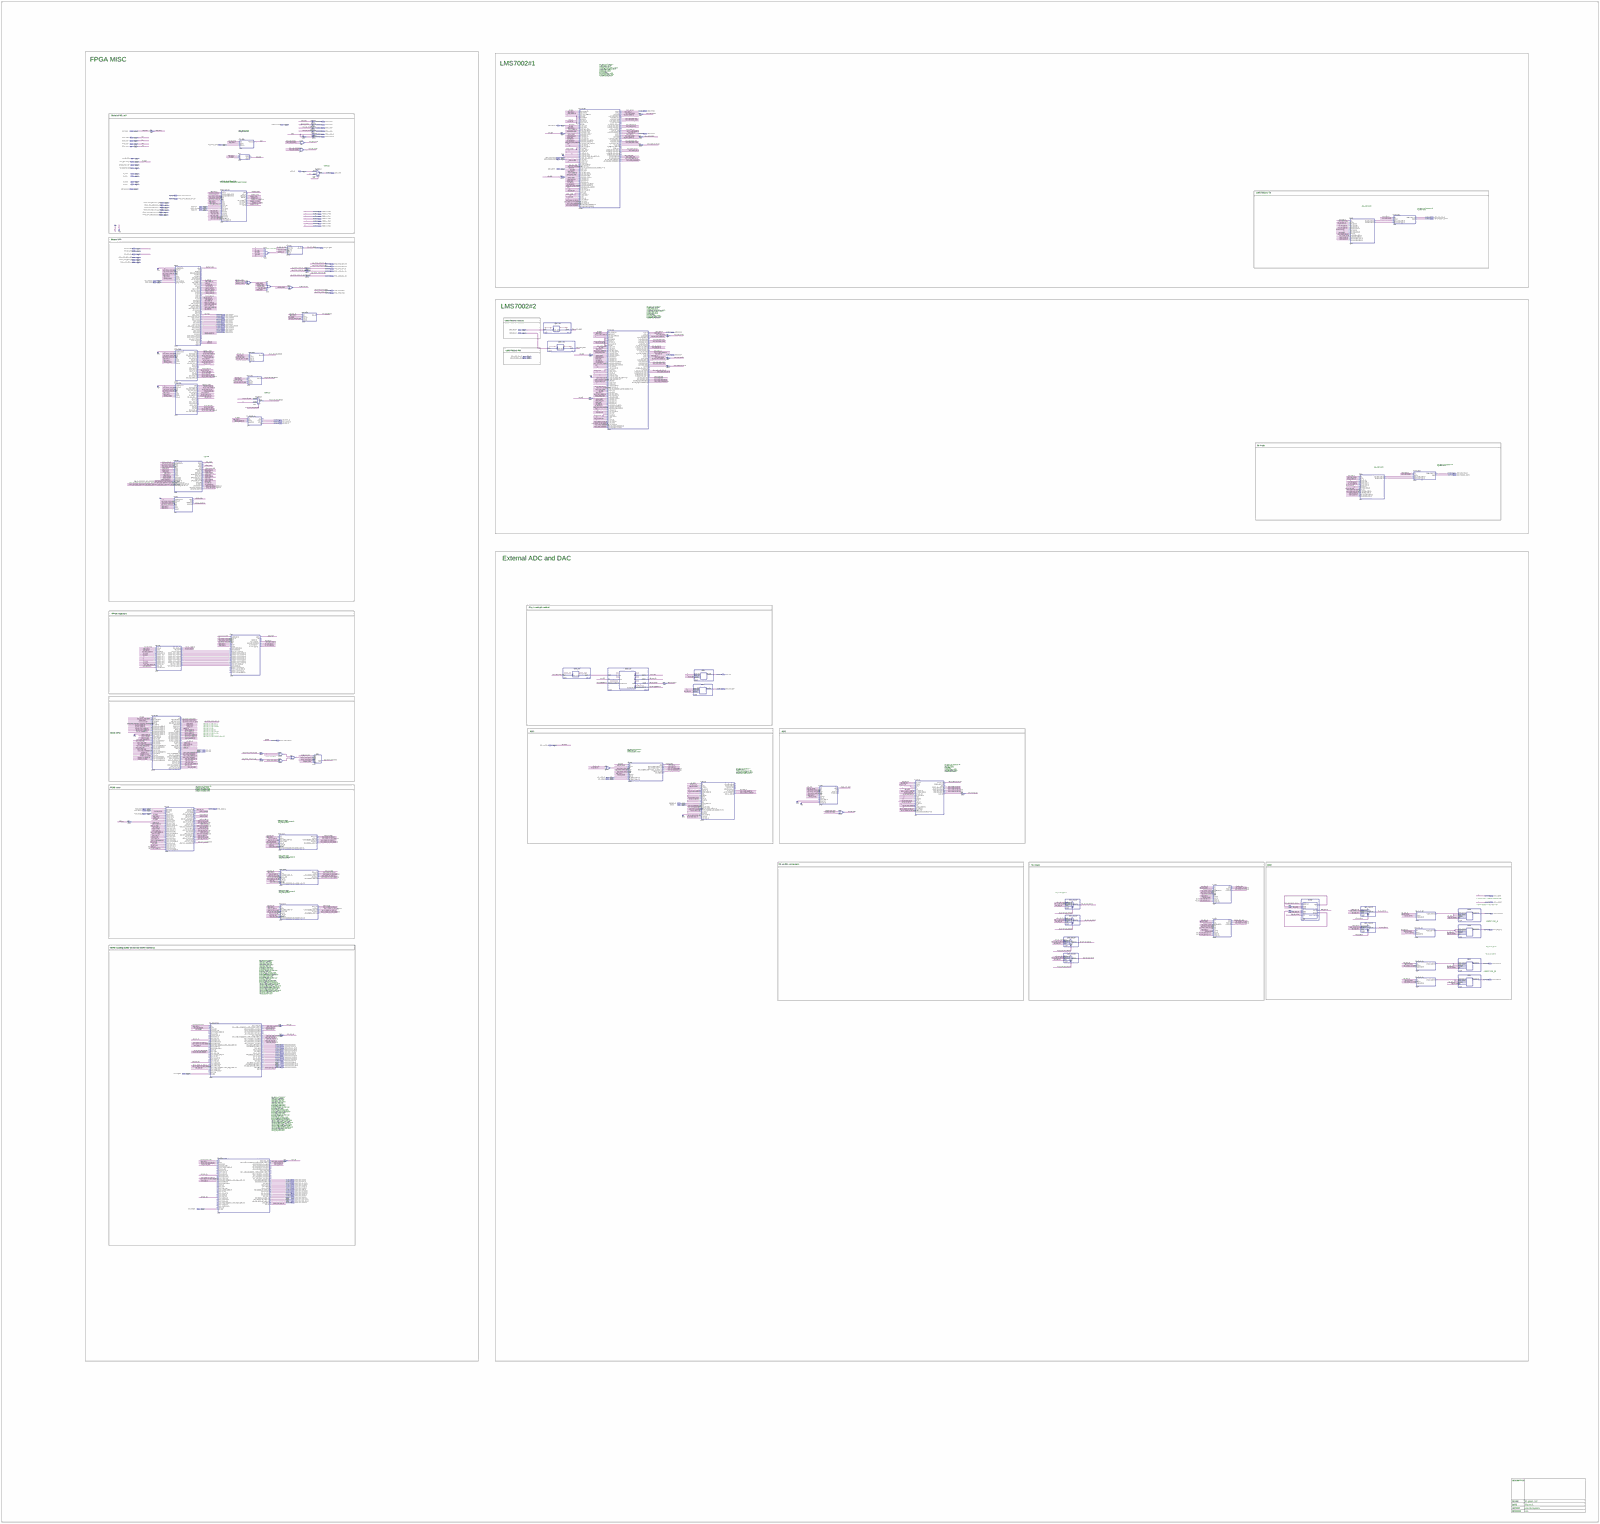
[diagram p0: schematic sheet, whole]
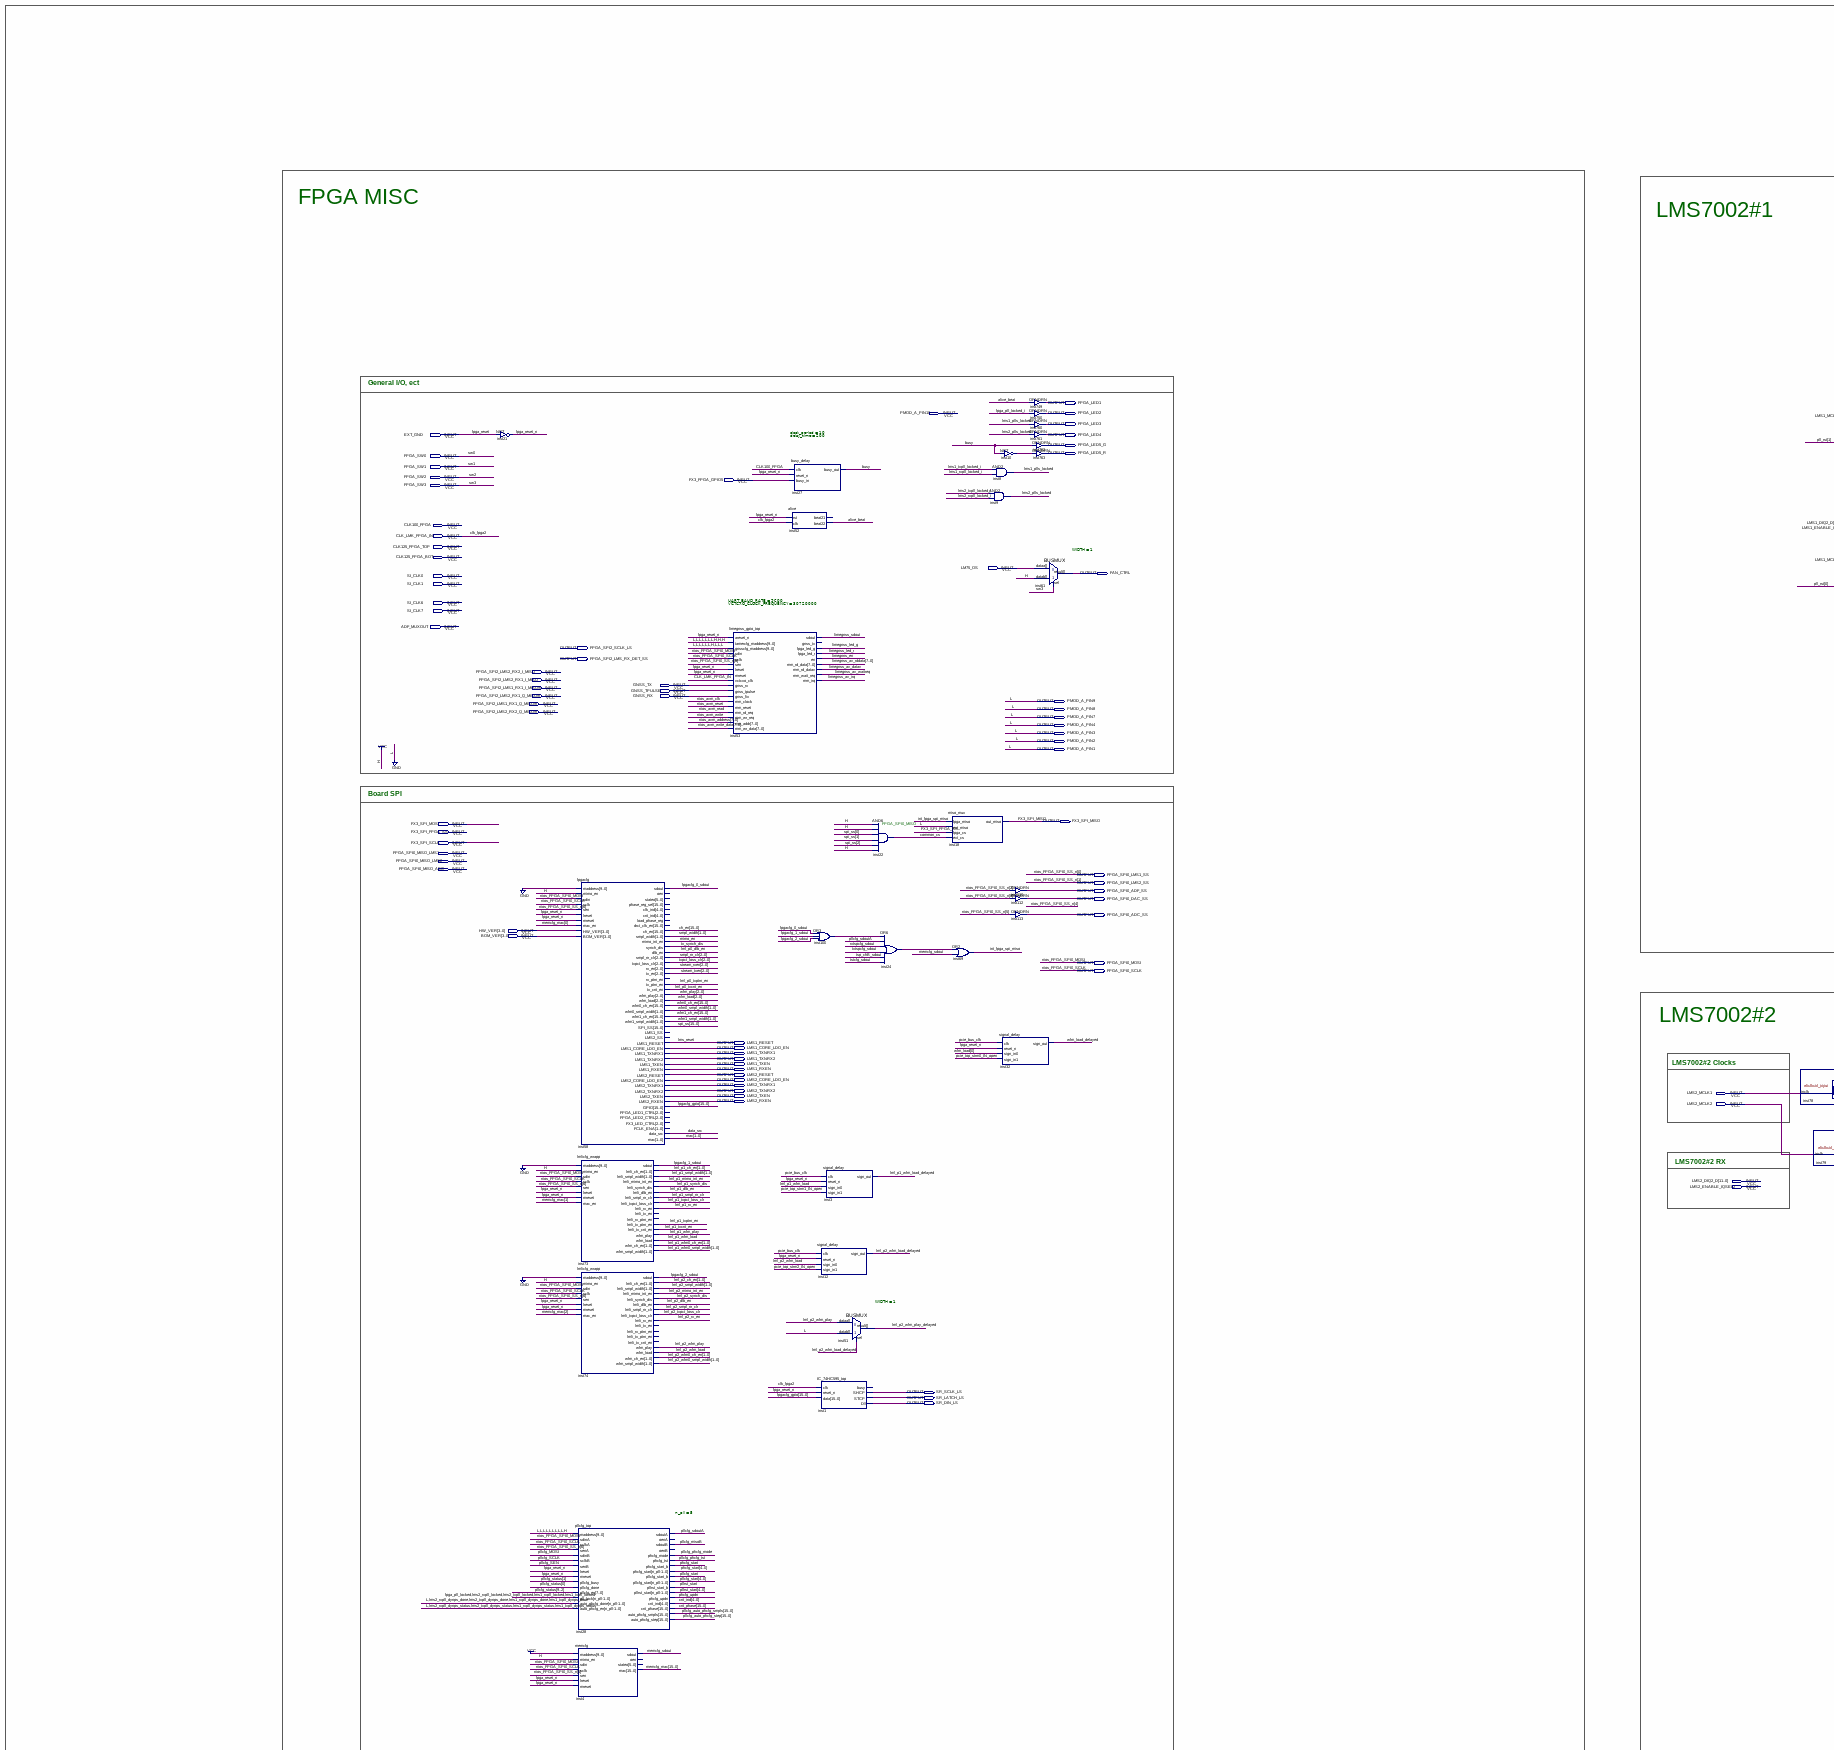
[diagram p1: schematic sheet, upper left part]
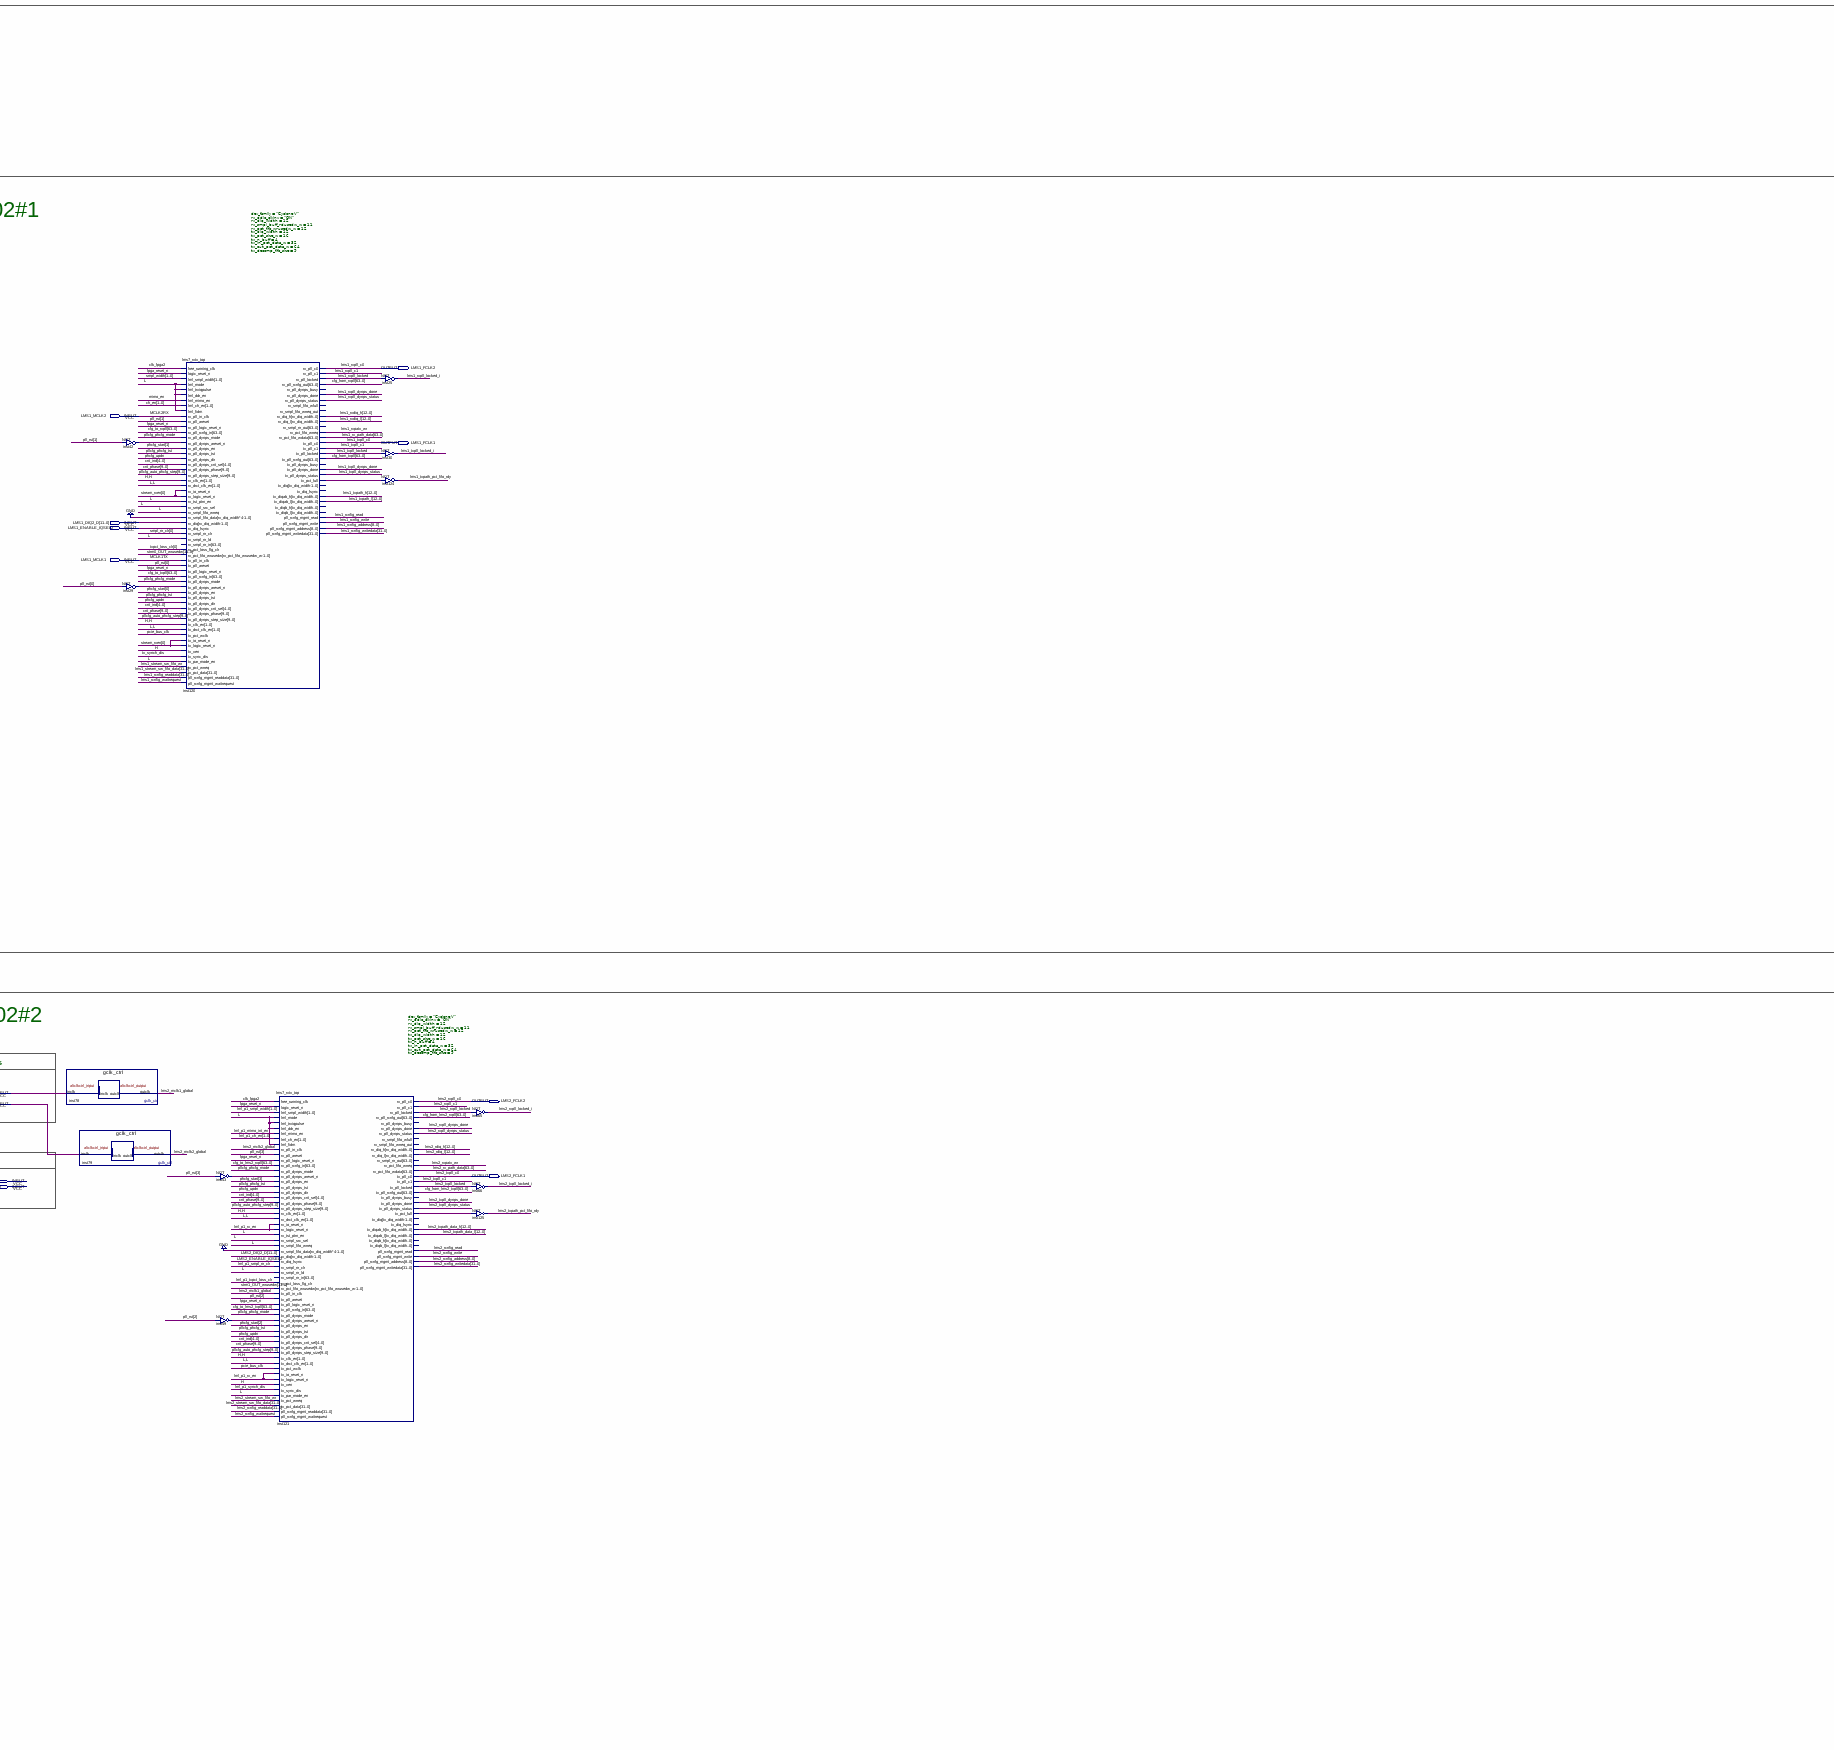
[diagram p2: schematic sheet, upper centre part]
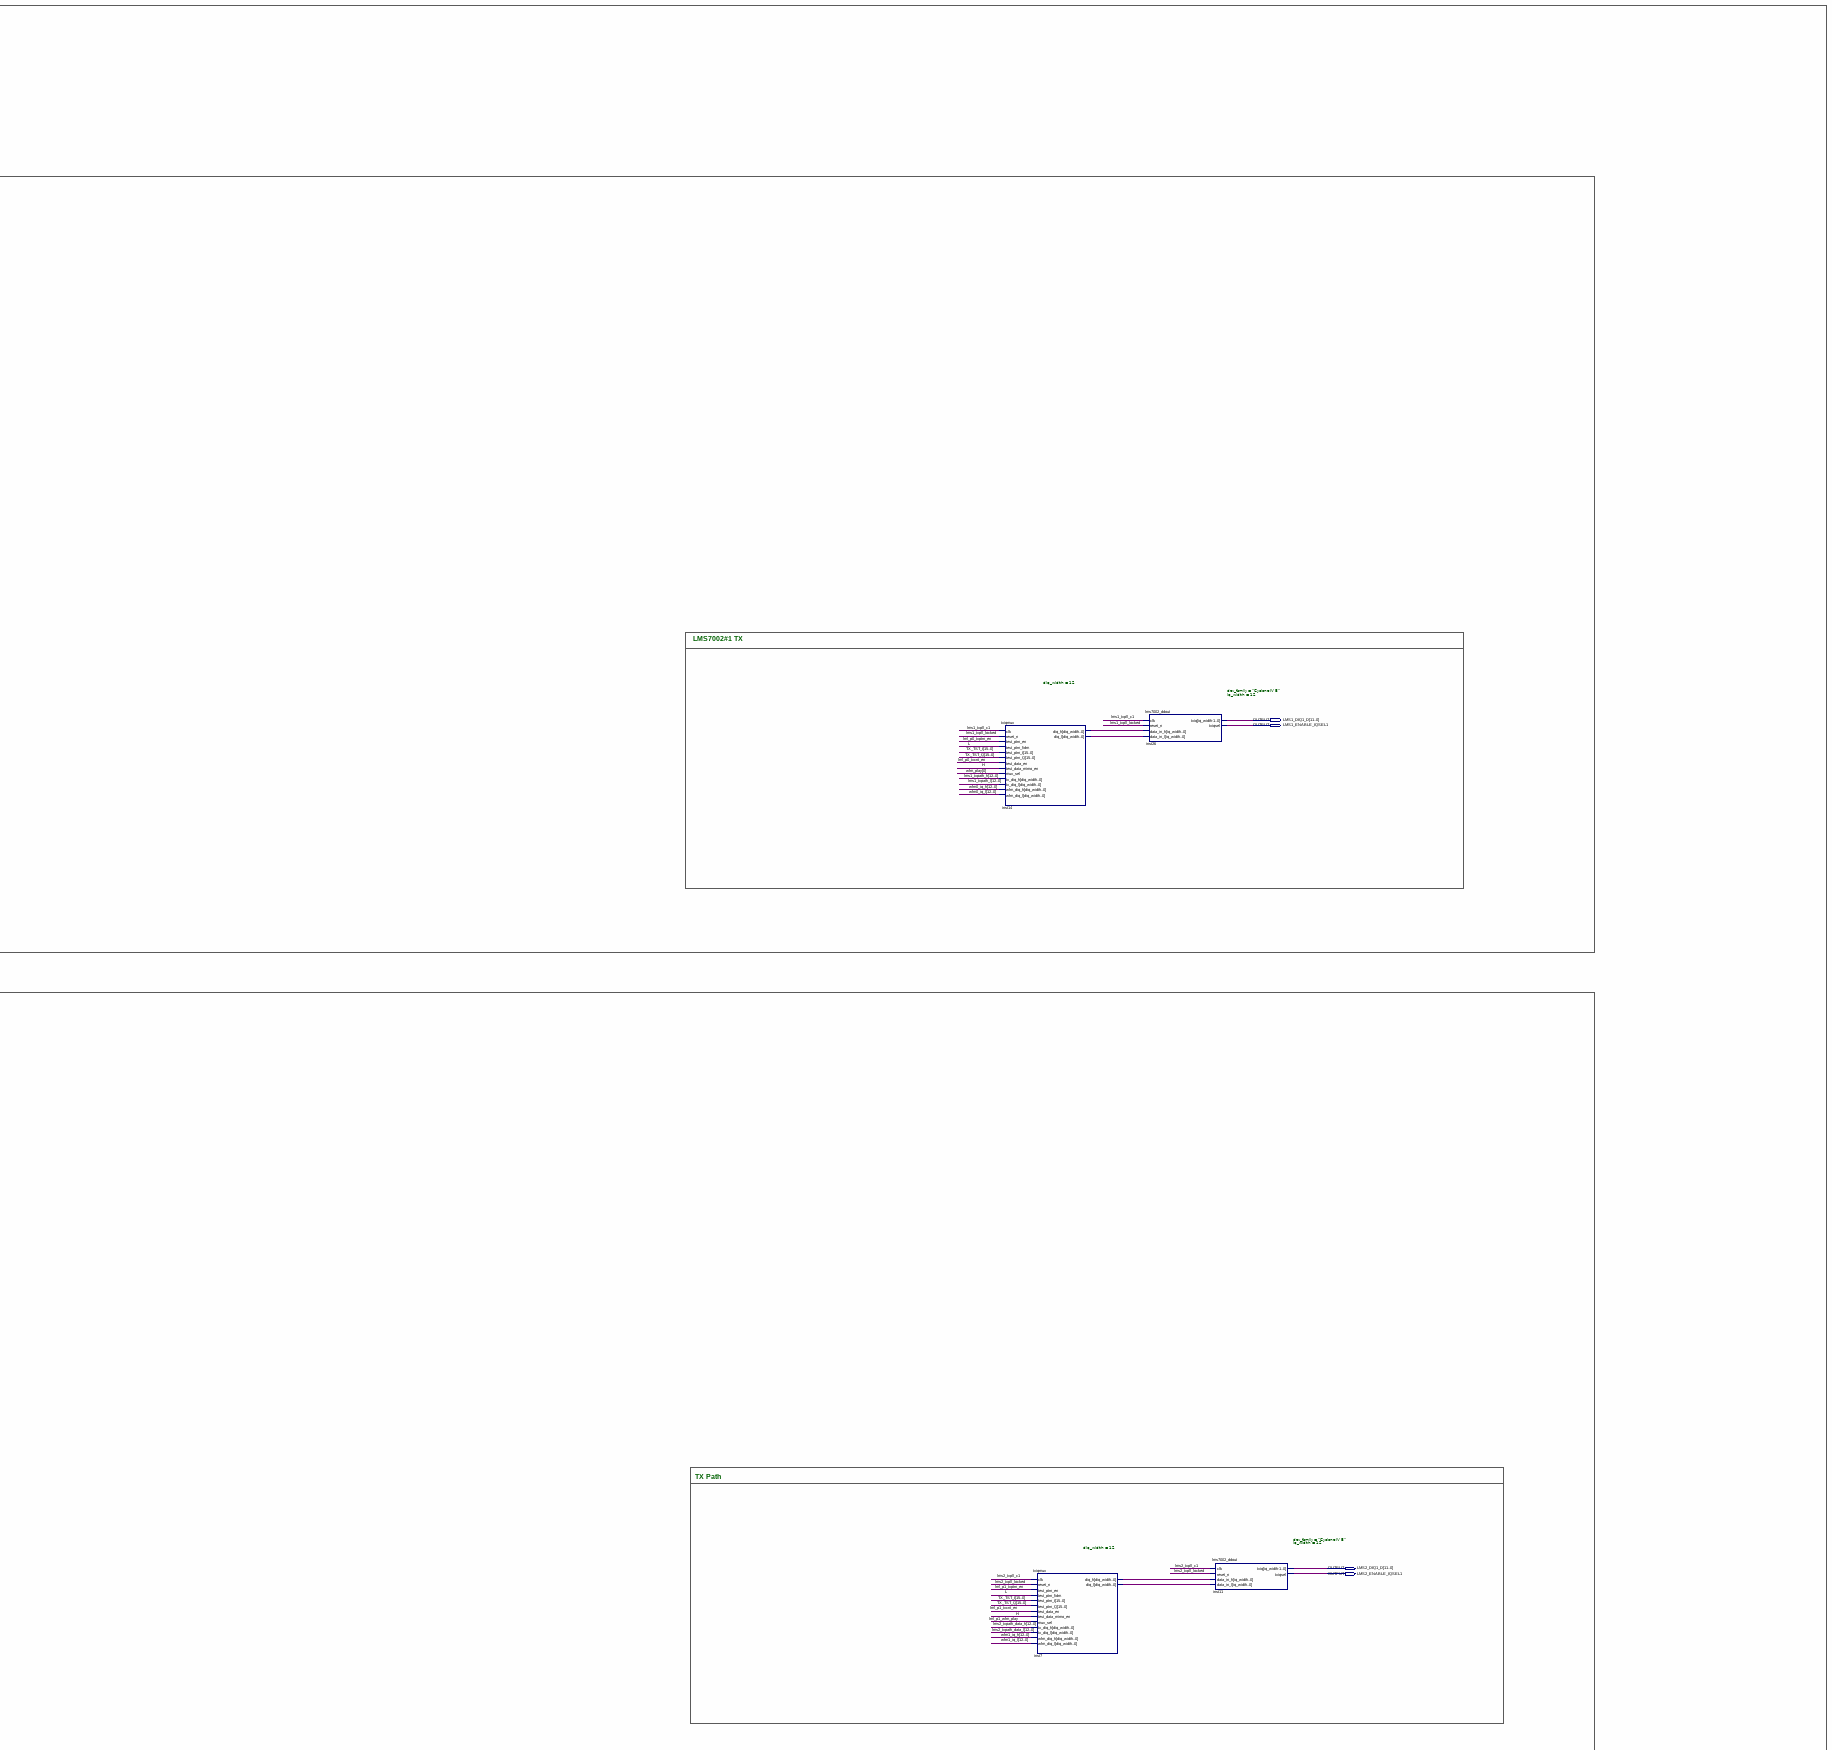
[diagram p3: schematic sheet, upper right part]
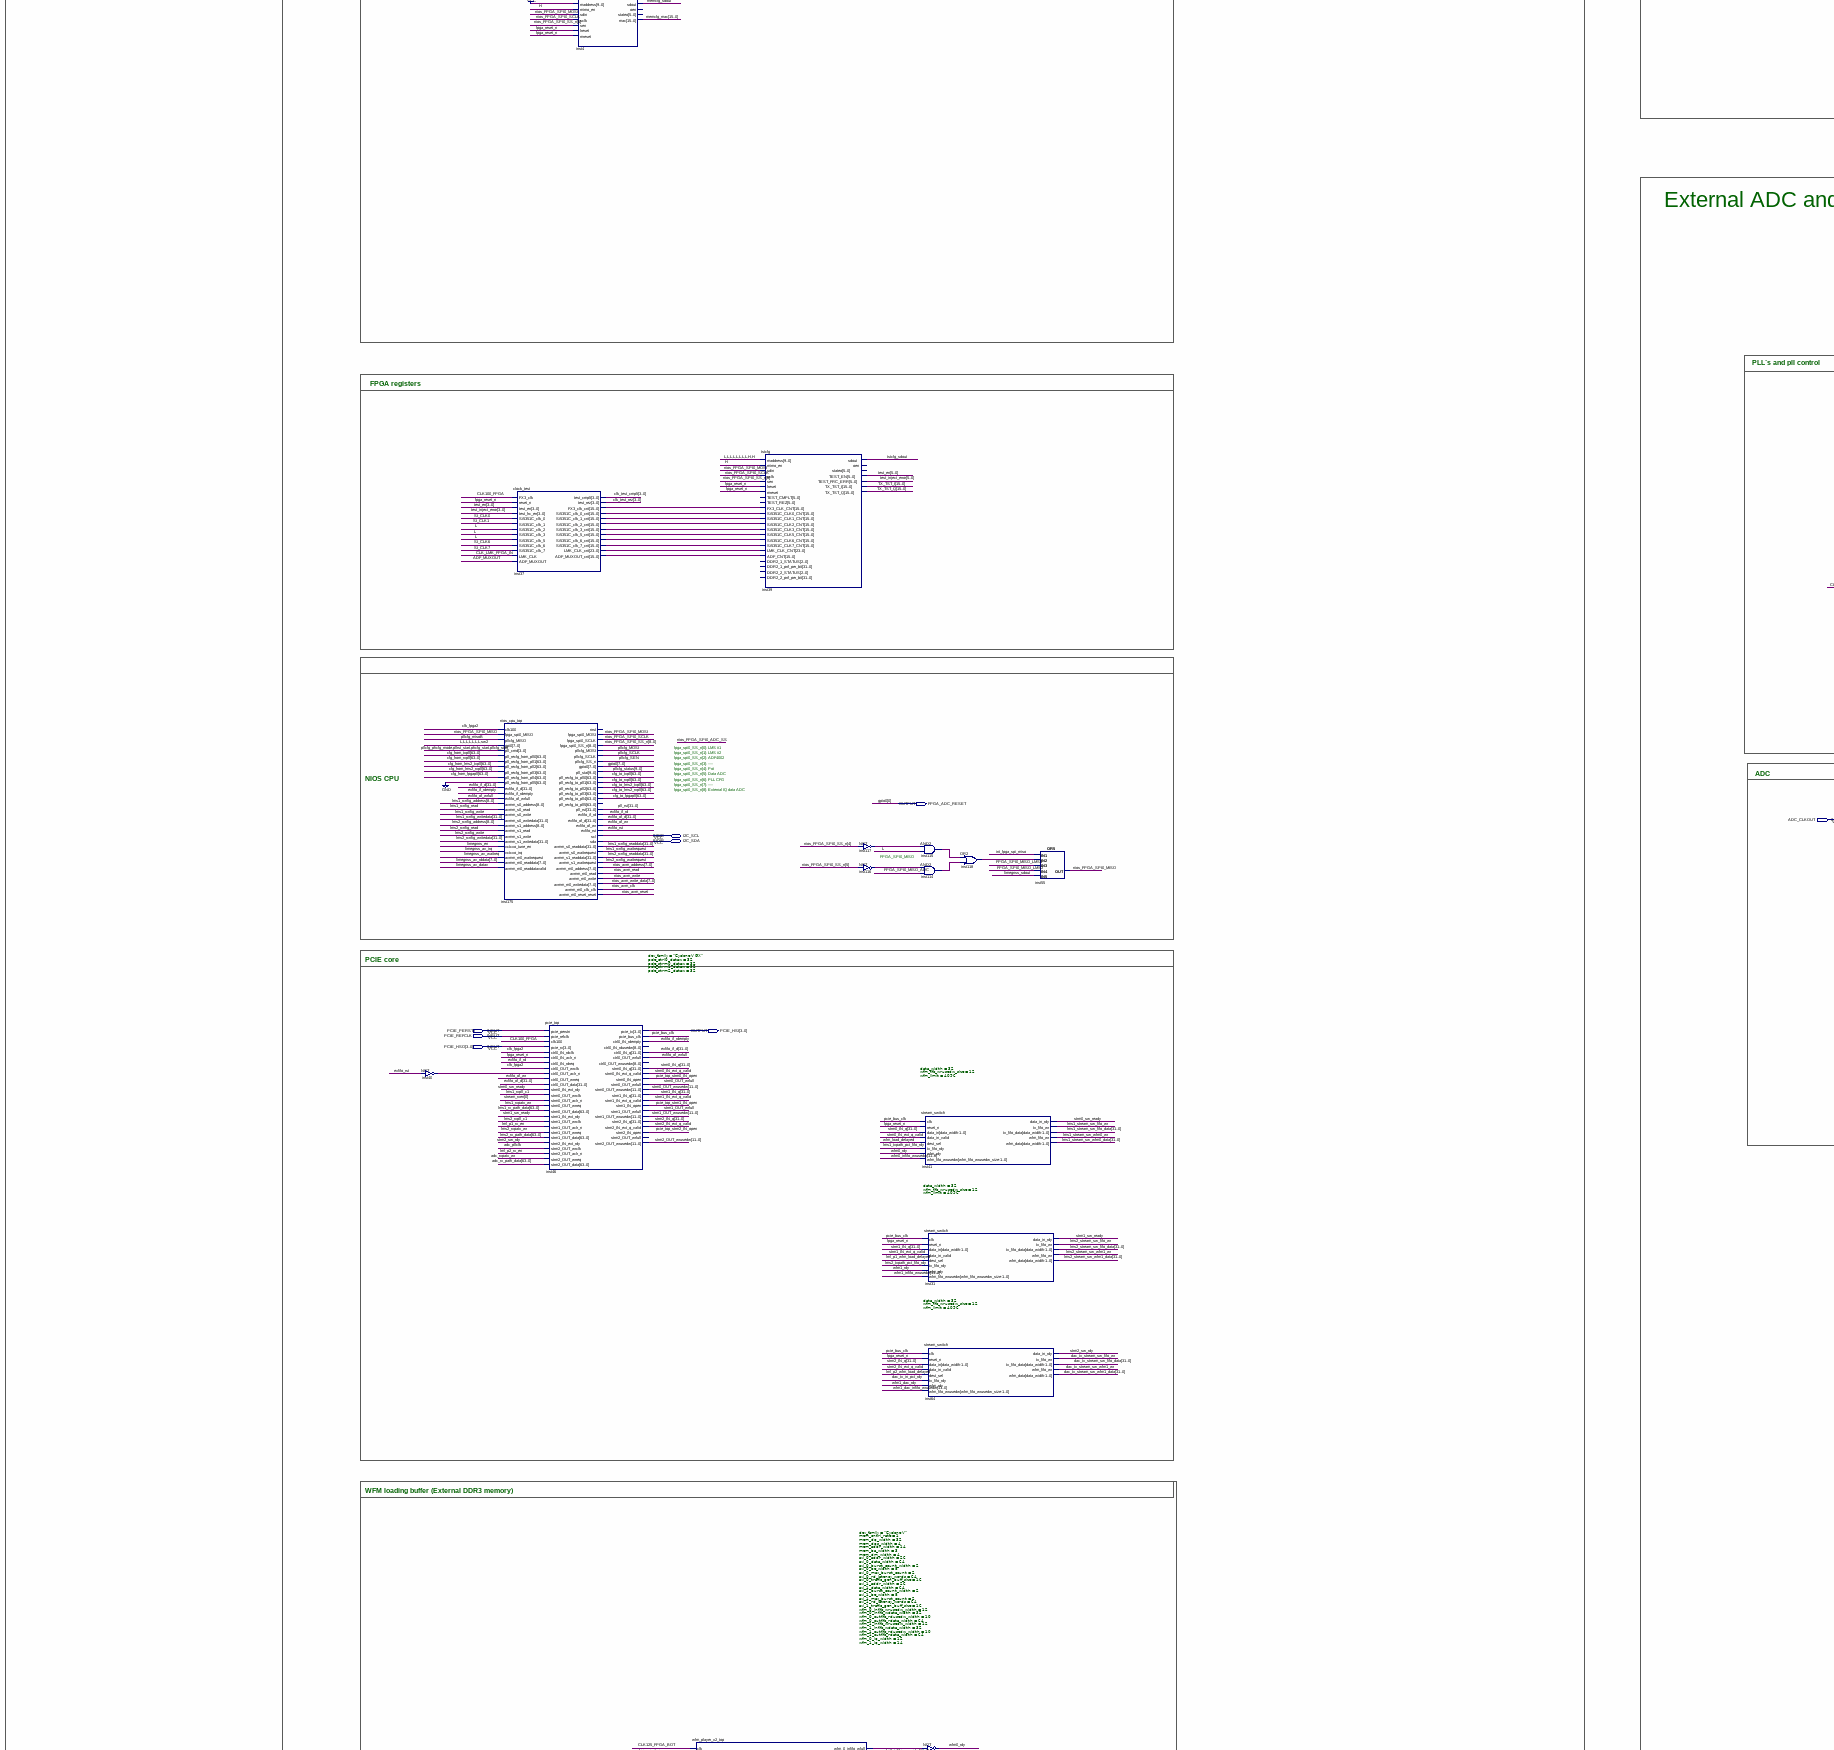
[diagram p4: schematic sheet, middle left part]
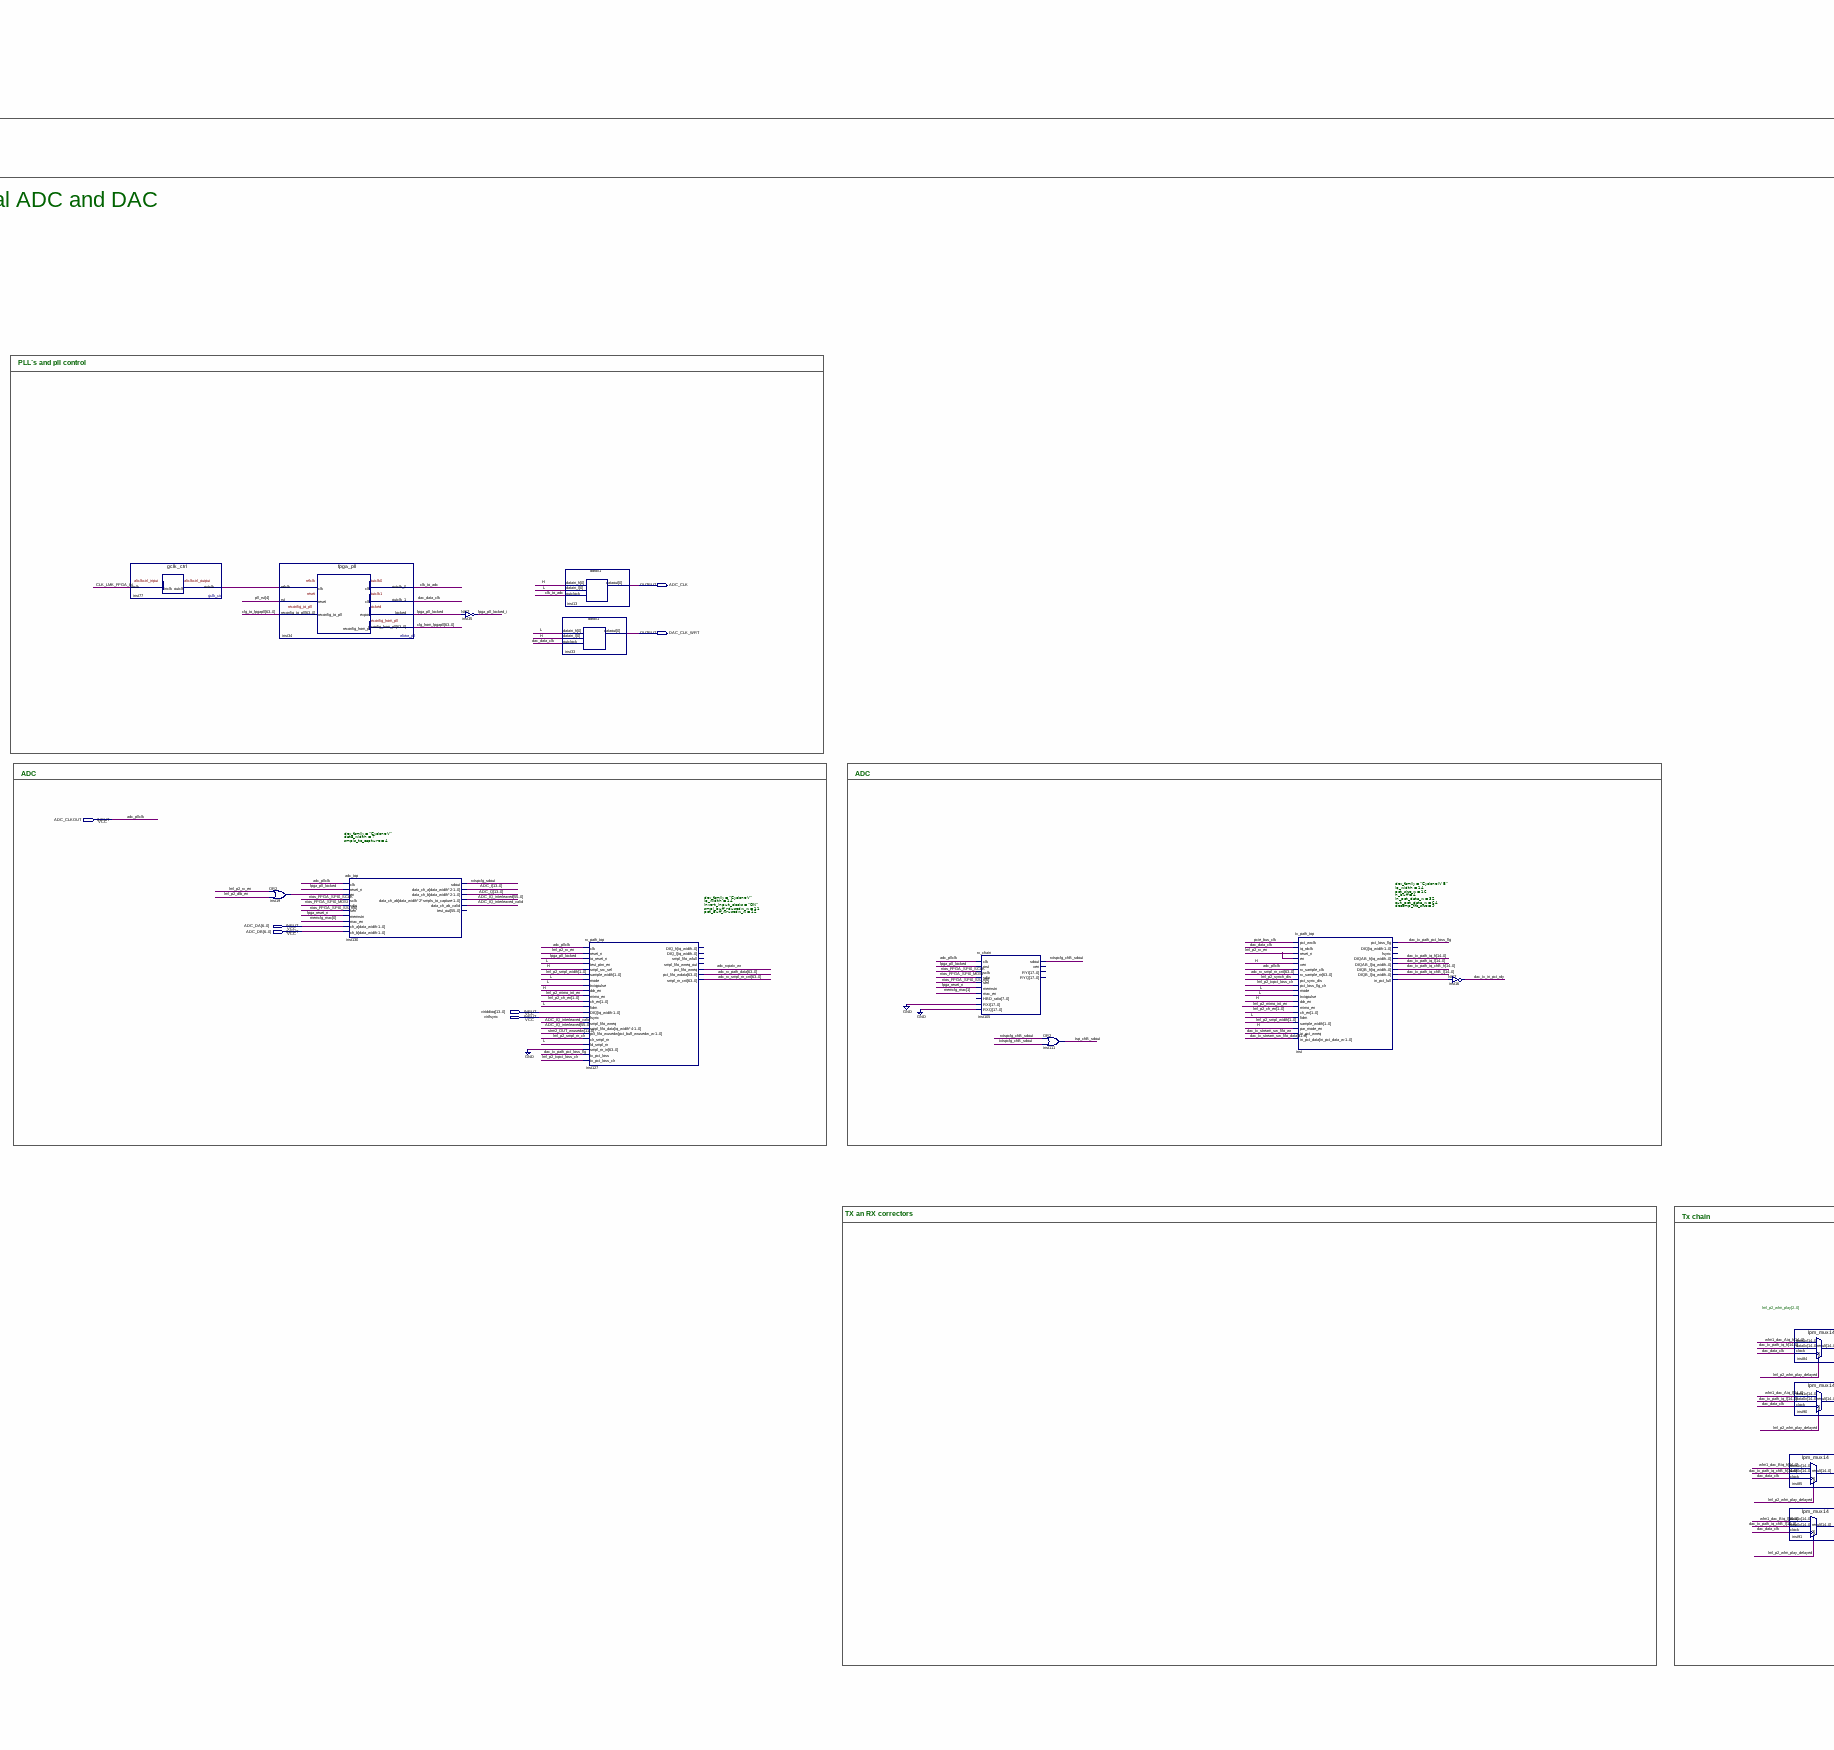
[diagram p5: schematic sheet, middle centre part]
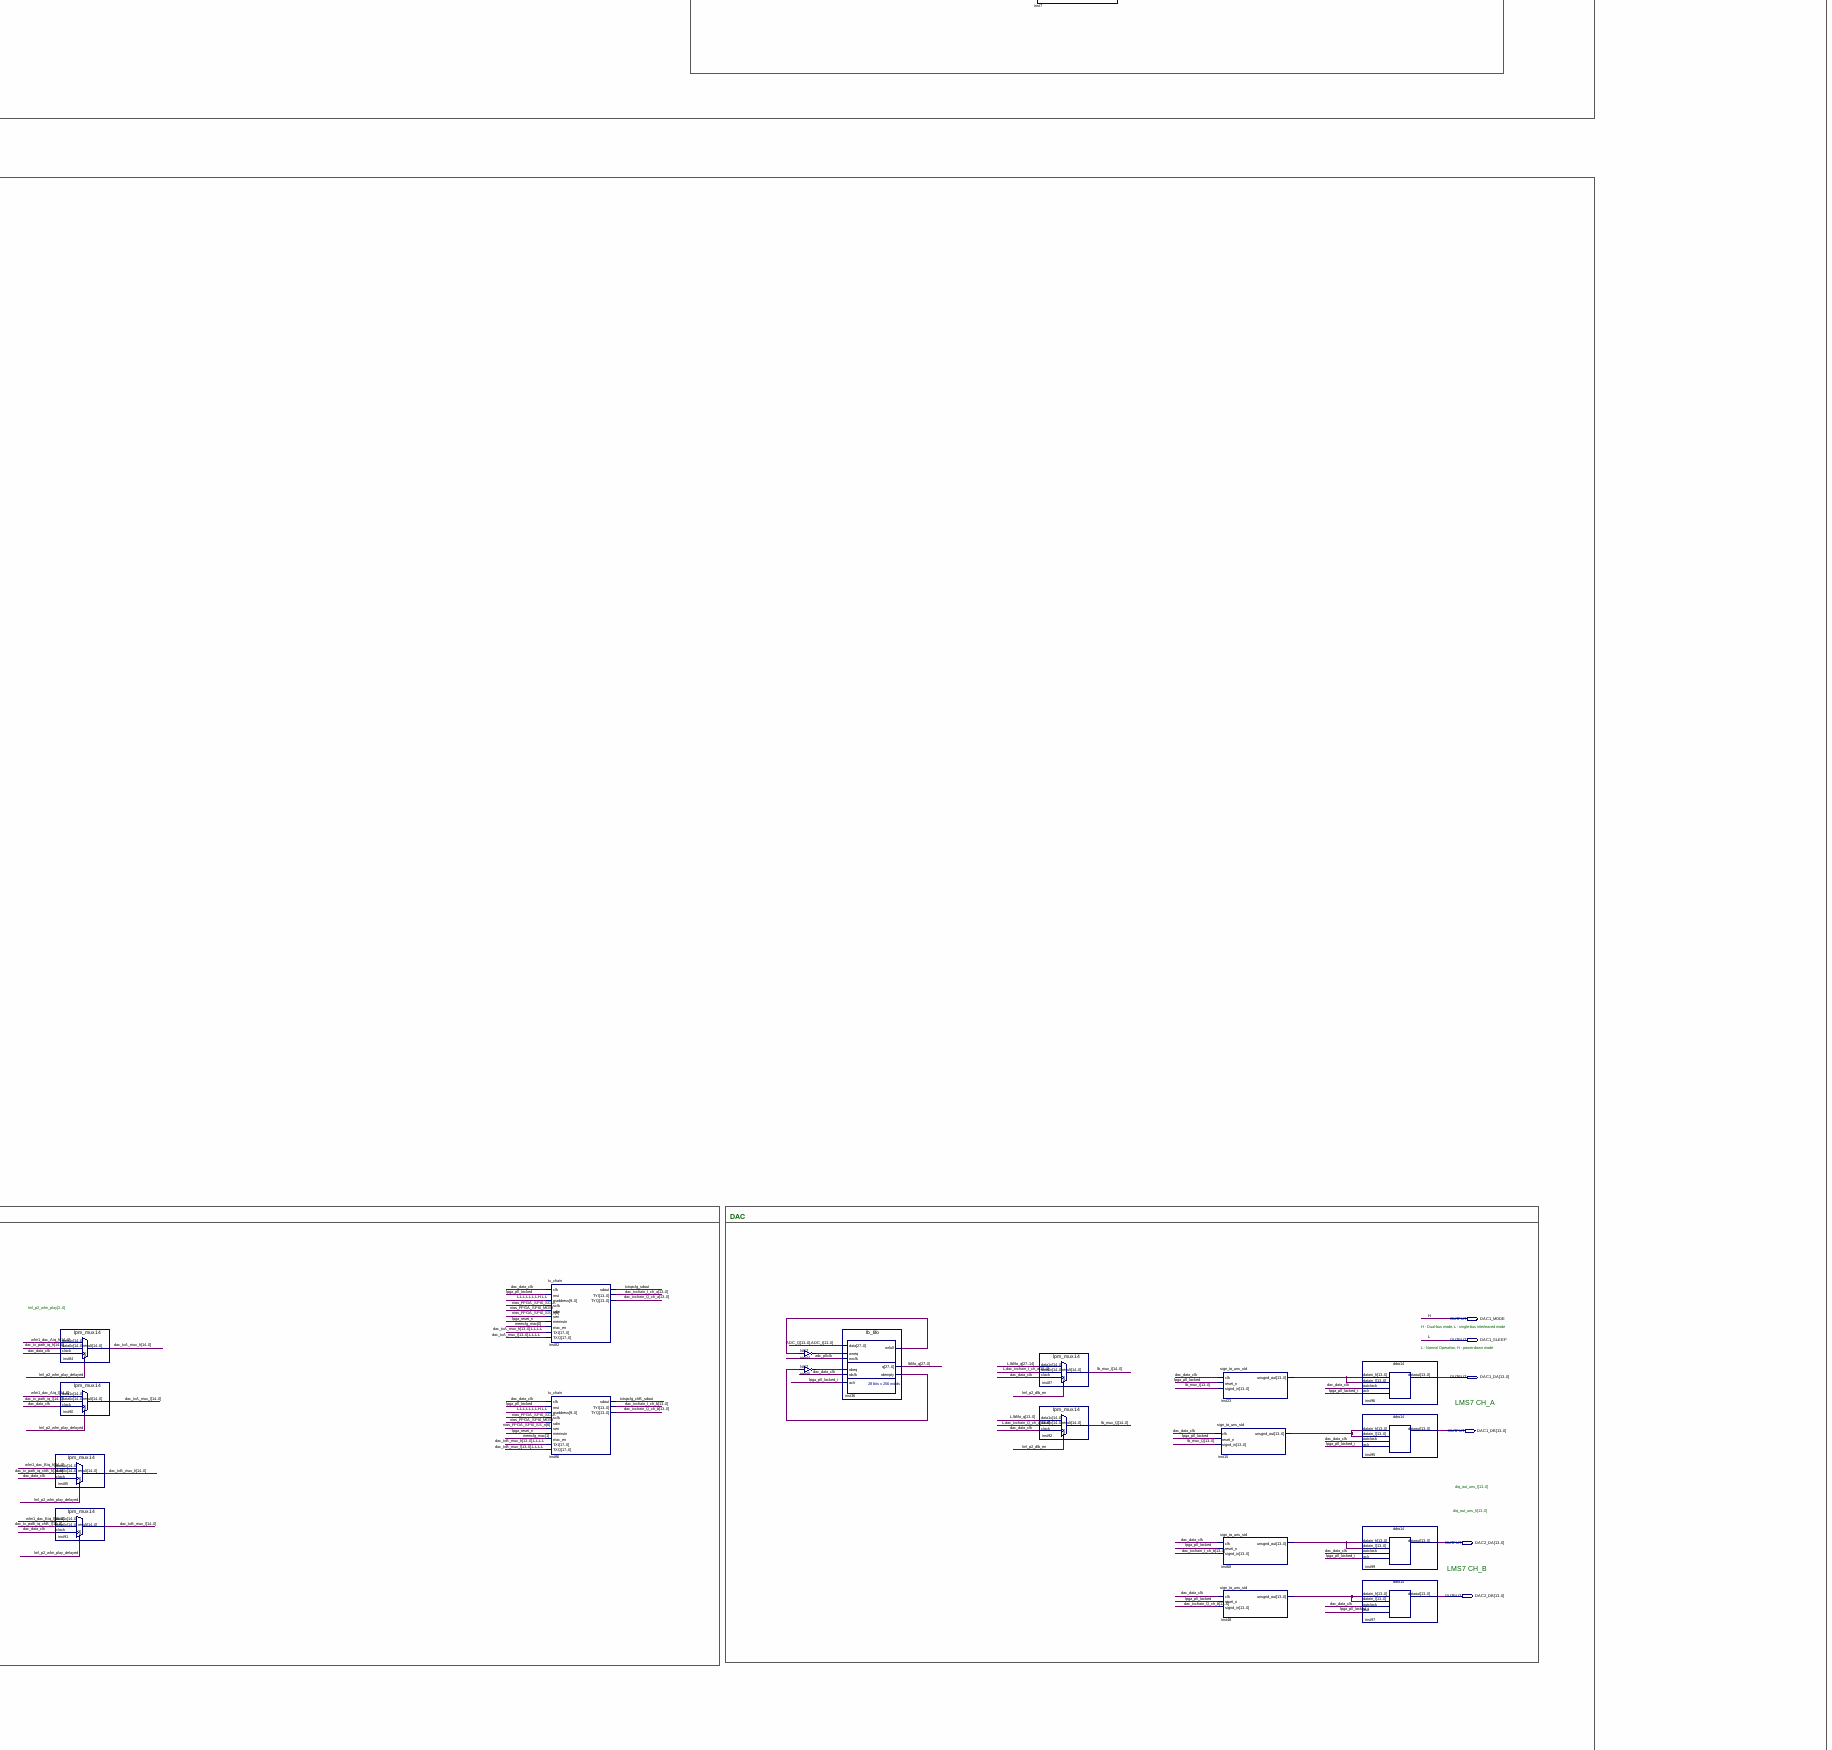
[diagram p6: schematic sheet, middle right part]
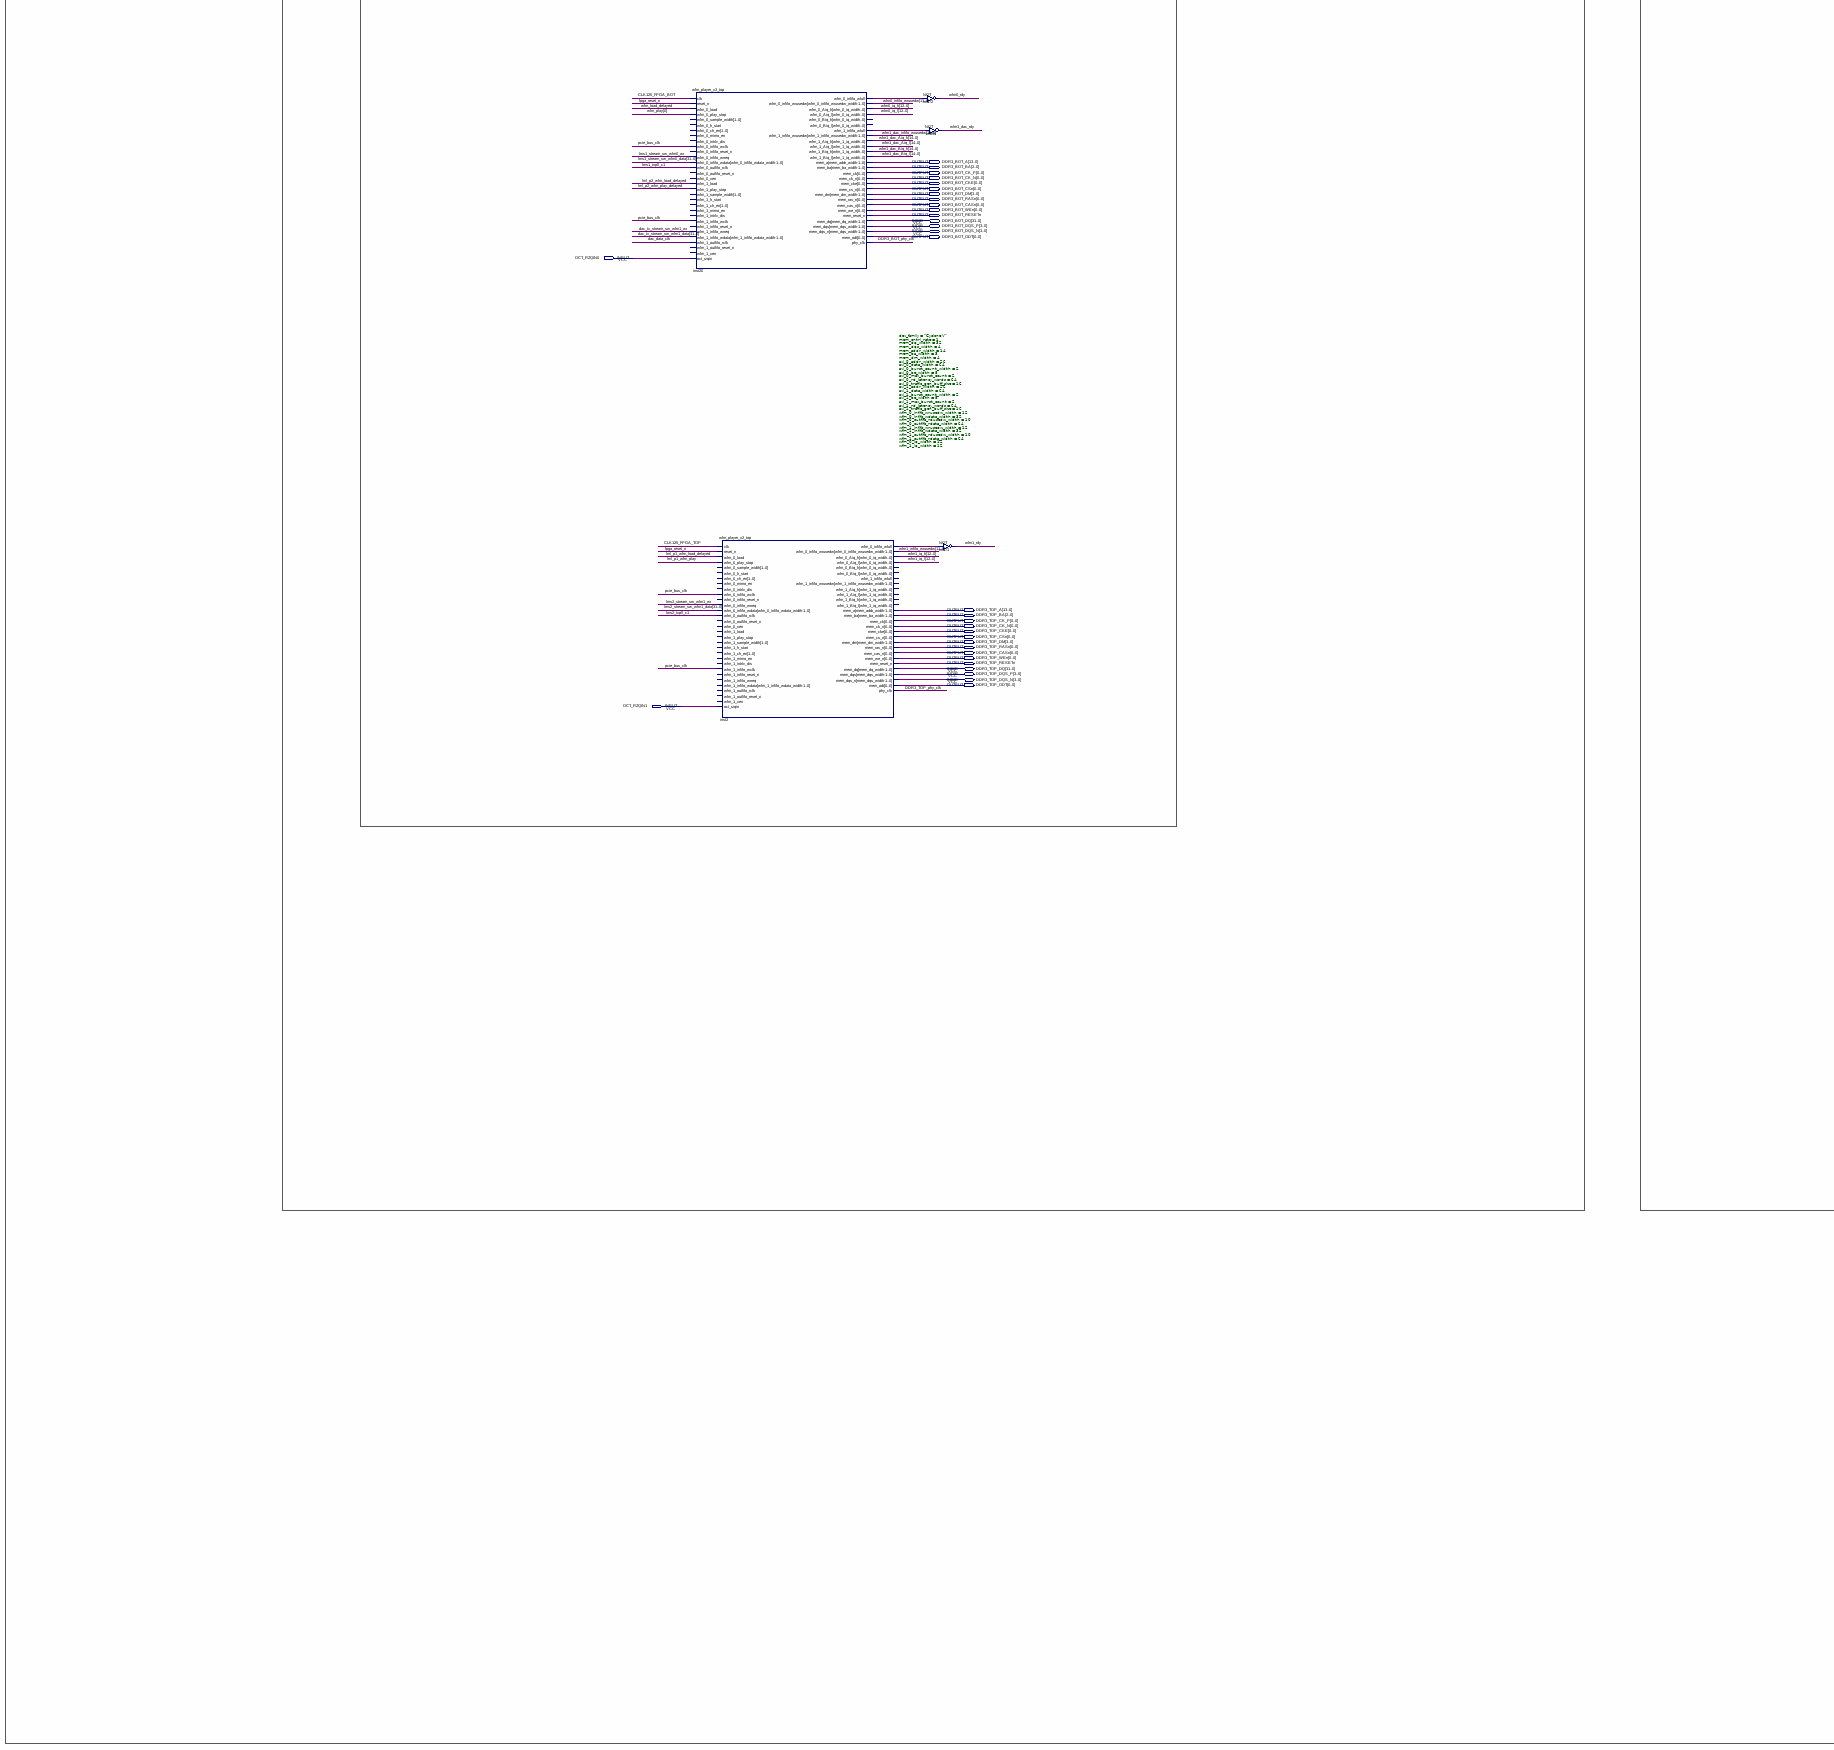
[diagram p7: schematic sheet, lower left part]
// Quartus schematic lms7_trx_top.bdf as structural Verilog: 100 symbols, 141 pins
module lms7_trx_top (
  input  PMOD_A_PIN10,
  input  LMS1_MCLK2,
  input  EXT_GND,
  input  FPGA_SW0,
  input  FPGA_SW1,
  input  FPGA_SW2,
  input  FX3_FPGA_GPIO5,
  input  FPGA_SW3,
  input  [11:0] LMS1_DIQ2_D,
  input  CLK100_FPGA,
  input  LMS1_ENABLE_IQSEL2,
  input  CLK_LMK_FPGA_IN,
  input  CLK125_FPGA_TOP,
  input  CLK125_FPGA_BOT,
  input  LMS1_MCLK1,
  input  LM75_OS,
  input  SI_CLK0,
  input  SI_CLK1,
  input  SI_CLK6,
  input  SI_CLK7,
  input  ADF_MUXOUT,
  input  FPGA_SPI2_LMS2_RX2_I_MISO,
  input  FPGA_SPI2_LMS2_RX1_I_MISO,
  input  GNSS_TX,
  input  \FPGA_SPI2_LMS1_RX1_I_MISO\n ,
  input  GNSS_TPULSE,
  input  \FPGA_SPI2_LMS2_RX1_Q_MISO\n ,
  input  GNSS_FIX,
  input  \FPGA_SPI2_LMS1_RX1_Q_MISO\n ,
  input  \FPGA_SPI2_LMS2_RX2_Q_MISO\n ,
  input  FX3_SPI_MOSI,
  input  FX3_SPI_FPGA_SS,
  input  FX3_SPI_SCLK,
  input  FPGA_SPI0_MISO_LMS1,
  input  FPGA_SPI0_MISO_LMS2,
  input  FPGA_SPI0_MISO_ADC,
  input  [3:0] HW_VER,
  input  [3:0] BOM_VER,
  input  LMS2_MCLK1,
  input  LMS2_MCLK2,
  input  [11:0] LMS2_DIQ2_D,
  input  LMS2_ENABLE_IQSEL2,
  input  ADC_CLKOUT,
  input  [6:0] ADC_DA,
  input  [6:0] ADC_DB,
  input  [13:0] virtddioq,
  input  virtfsync,
  input  PCIE_PERSTn,
  input  PCIE_REFCLK,
  input  [3:0] PCIE_HSO,
  input  OCT_RZQIN0,
  input  OCT_RZQIN1,
  inout  I2C_SCL,
  inout  I2C_SDA,
  inout  [31:0] DDR3_BOT_DQ,
  inout  [3:0] DDR3_BOT_DQS_P,
  inout  [3:0] DDR3_BOT_DQS_N,
  inout  [31:0] DDR3_TOP_DQ,
  inout  [3:0] DDR3_TOP_DQS_P,
  inout  [3:0] DDR3_TOP_DQS_N,
  output LMS1_FCLK2,
  output FPGA_LED1,
  output FPGA_LED2,
  output FPGA_LED3,
  output FPGA_LED4,
  output LMS1_FCLK1,
  output FPGA_LED5_G,
  output FPGA_LED5_R,
  output FAN_CTRL,
  output FPGA_SPI2_SCLK_LS,
  output FPGA_SPI2_LMS_RX_DET_SS,
  output PMOD_A_PIN9,
  output PMOD_A_PIN8,
  output PMOD_A_PIN7,
  output [11:0] LMS1_DIQ1_D,
  output PMOD_A_PIN4,
  output LMS1_ENABLE_IQSEL1,
  output PMOD_A_PIN3,
  output PMOD_A_PIN2,
  output PMOD_A_PIN1,
  output FX3_SPI_MISO,
  output FPGA_SPI0_LMS1_SS,
  output FPGA_SPI0_LMS2_SS,
  output FPGA_SPI0_ADF_SS,
  output FPGA_SPI0_DAC_SS,
  output FPGA_SPI0_ADC_SS,
  output FPGA_SPI0_MOSI,
  output FPGA_SPI0_SCLK,
  output LMS1_RESET,
  output LMS1_CORE_LDO_EN,
  output LMS1_TXNRX1,
  output LMS1_TXNRX2,
  output LMS1_TXEN,
  output LMS1_RXEN,
  output LMS2_RESET,
  output LMS2_CORE_LDO_EN,
  output LMS2_TXNRX1,
  output LMS2_TXNRX2,
  output LMS2_TXEN,
  output LMS2_RXEN,
  output LMS2_FCLK2,
  output LMS2_FCLK1,
  output SR_SCLK_LS,
  output SR_LATCH_LS,
  output SR_DIN_LS,
  output [11:0] LMS2_DIQ1_D,
  output LMS2_ENABLE_IQSEL1,
  output ADC_CLK,
  output DAC_CLK_WRT,
  output FPGA_ADC_RESET,
  output [3:0] PCIE_HSI,
  output DAC1_MODE,
  output DAC1_SLEEP,
  output [13:0] DAC1_DA,
  output [13:0] DAC1_DB,
  output [13:0] DAC2_DA,
  output [13:0] DAC2_DB,
  output [13:0] DDR3_BOT_A,
  output [2:0] DDR3_BOT_BA,
  output [0:0] DDR3_BOT_CK_P,
  output [0:0] DDR3_BOT_CK_N,
  output [0:0] DDR3_BOT_CKE,
  output [0:0] DDR3_BOT_CSn,
  output [3:0] DDR3_BOT_DM,
  output [0:0] DDR3_BOT_RASn,
  output [0:0] DDR3_BOT_CASn,
  output [0:0] DDR3_BOT_WEn,
  output DDR3_BOT_RESETn,
  output [0:0] DDR3_BOT_ODT,
  output [13:0] DDR3_TOP_A,
  output [2:0] DDR3_TOP_BA,
  output [0:0] DDR3_TOP_CK_P,
  output [0:0] DDR3_TOP_CK_N,
  output [0:0] DDR3_TOP_CKE,
  output [0:0] DDR3_TOP_CSn,
  output [3:0] DDR3_TOP_DM,
  output [0:0] DDR3_TOP_RASn,
  output [0:0] DDR3_TOP_CASn,
  output [0:0] DDR3_TOP_WEn,
  output DDR3_TOP_RESETn,
  output [0:0] DDR3_TOP_ODT
);

  wire ADC_IQ_interleaved_valid, adc_rxpatx_wr, alive_beat, busy, clk_to_adc, common_cs, dac_data_clk,
       dac_tx_in_pct_rdy, dac_tx_path_pct_loss_flg, dac_tx_stream_sw_fifo_wr, dac_tx_stream_sw_wfm1_wr,
       data_src, DDR3_BOT_phy_clk, DDR3_TOP_phy_clk, exfifo_if_rd, exfifo_if_rdempty, exfifo_of_wr,
       exfifo_of_wrfull, exfifo_rst, fpga_pll_locked, fpga_pll_locked_i, fpga_reset_n, fpgacfg_0_sdout,
       fpgacfg_1_sdout, fpgacfg_2_sdout, inst2_wfm_0_infifo_wfull, inst10_out, inst19_out,
       inst20_wfm_0_infifo_wfull, inst20_wfm_1_infifo_wfull, inst24_out, inst29_out, inst36_rdempty,
       inst36_wrfull, inst40_out, inst42_out, inst43_out, inst44_out, inst45_out, inst49_out, inst77_outclk,
       inst100_out, inst114_out, inst115_out, inst116_out, inst117_out, inst118_out, inst120_tx_pct_full,
       inst121_tx_pct_full, inst_in_pct_full, int_fpga_spi_miso, limegnns_en, limegnss_av_datav,
       limegnss_av_irq, limegnss_av_waitreq, limegnss_led_g, limegnss_led_r, limegnss_sdout, lml_p0_dlb_en,
       lml_p0_txcnt_en, lml_p0_txptrn_en, lml_p1_dlb_en, lml_p1_mimo_int_en, lml_p1_rx_en,
       lml_p1_smpl_nr_clr, lml_p1_synch_dis, lml_p1_txcnt_en, lml_p1_txpct_loss_clr, lml_p1_txptrn_en,
       lml_p1_wfm_load, lml_p1_wfm_load_delayed, lml_p1_wfm_play, lml_p2_dlb_en, lml_p2_mimo_int_en,
       lml_p2_rx_en, lml_p2_smpl_nr_clr, lml_p2_synch_dis, lml_p2_txpct_loss_clr, lml_p2_wfm_load,
       lml_p2_wfm_load_delayed, lml_p2_wfm_play, lml_p2_wfm_play_delayed, lms1_plls_locked, lms1_rcnfig_read,
       lms1_rcnfig_waitrequest, lms1_rcnfig_write, lms1_rxpatx_wr, lms1_rxpll_c1, lms1_rxpll_dynps_done,
       lms1_rxpll_dynps_status, lms1_rxpll_locked, lms1_rxpll_locked_i, lms1_stream_sw_fifo_wr,
       lms1_stream_sw_wfm0_wr, lms1_txpath_pct_fifo_rdy, lms1_txpll_c1, lms1_txpll_dynps_done,
       lms1_txpll_dynps_status, lms1_txpll_locked, lms1_txpll_locked_i, lms2_mclk1_global, lms2_mclk2_global,
       lms2_plls_locked, lms2_rcnfig_read, lms2_rcnfig_waitrequest, lms2_rcnfig_write, lms2_rxpatx_wr,
       lms2_rxpll_c1, lms2_rxpll_dynps_done, lms2_rxpll_dynps_status, lms2_rxpll_locked, lms2_rxpll_locked_i,
       lms2_stream_sw_fifo_wr, lms2_stream_sw_wfm1_wr, lms2_txpath_pct_fifo_rdy, lms2_txpll_c1,
       lms2_txpll_dynps_done, lms2_txpll_dynps_status, lms2_txpll_locked, lms2_txpll_locked_i, memcfg_sdout,
       mimo_en, nios_avm_clk, nios_avm_read, nios_avm_reset, nios_avm_write, nios_FPGA_SPI0_MISO,
       pcie_bus_clk, pcie_top_strm0_IN_open, pcie_top_strm1_IN_open, pcie_top_strm2_IN_open,
       phcfg_start_1bit, phcfg_updn, pllcfg_misoB, pllcfg_MOSI, pllcfg_phcfg_mode, pllcfg_phcfg_tst,
       pllcfg_SCLK, pllcfg_sdoutA, pllcfg_SEN, pllcfg_start_1bit, pllrst_start_1bit, rxtspcfg_chB_sdout,
       rxtspcfg_sdout, strm0_IN_ext_q_valid, strm0_OUT_wrfull, strm0_sw_ready, strm1_IN_ext_q_valid,
       strm1_OUT_wrfull, strm1_sw_ready, strm2_IN_ext_q_valid, strm2_sw_rdy, tsp_chB_sdout, tstcfg_sdout,
       tx_synch_dis, txtspcfg_chB_sdout, txtspcfg_sdout, wfm0_rdy, wfm1_dac_rdy, wfm1_rdy, wfm_load_delayed;
  wire [1:0] lml_p1_ch_en, lml_p1_smpl_width, lml_p1_wfm0_ch_en, lml_p1_wfm0_smpl_width, lml_p2_ch_en,
       lml_p2_smpl_width, lml_p2_wfm0_ch_en, lml_p2_wfm0_smpl_width, mac, smpl_width, wfm0_smpl_width,
       wfm1_smpl_width;
  wire [2:0] smpl_nr_clr, stream_rxen, stream_txen, txpct_loss_clr, wfm_load, wfm_play;
  wire [3:0] clk_test_cmplt, clk_test_rez;
  wire [4:0] cnt_ind, phcfg_start, pllcfg_start, pllrst_start;
  wire [5:0] test_en, test_inject_error;
  wire [7:0] limegnss_av_rddata, nios_avm_address, nios_avm_write_data;
  wire [7:1] gpio0;
  wire [8:0] lms1_rcnfig_address, lms2_rcnfig_address;
  wire [8:2] nios_FPGA_SPI0_SS_n;
  wire [9:0] pllcfg_status;
  wire [11:0] strm0_OUT_wrusedw, strm1_OUT_wrusedw, strm2_OUT_wrusedw, wfm0_infifo_wrusedw,
       wfm1_dac_infifo_wrusedw, wfm1_infifo_wrusedw;
  wire [12:0] inst7_diq_h, inst7_diq_l, inst14_diq_h, inst14_diq_l, lms1_rxdiq_h, lms1_rxdiq_l,
       lms1_txpath_h, lms1_txpath_l, lms2_rdiq_h, lms2_rdiq_l, lms2_txpath_data_h, lms2_txpath_data_l,
       wfm0_iq_h, wfm0_iq_l, wfm1_iq_h, wfm1_iq_l;
  wire [13:0] ADC_I, ADC_Q, dac_txchain_I_ch_a, dac_txchain_I_ch_b, dac_txchain_Q_ch_a, dac_txchain_Q_ch_b,
       inst15_unsgnd_out, inst23_unsgnd_out, inst48_unsgnd_out, inst68_unsgnd_out;
  wire [14:0] dac_tx_path_iq_chB_h, dac_tx_path_iq_chB_l, dac_tx_path_iq_h, dac_tx_path_iq_l, dac_txA_mux_h,
       dac_txA_mux_l, dac_txB_mux_h, dac_txB_mux_l, lb_mux_I, lb_mux_Q, wfm1_dac_Aiq_h, wfm1_dac_Aiq_l,
       wfm1_dac_Biq_h, wfm1_dac_Biq_l;
  wire [15:0] ch_en, cnt_phase, fpgacfg_gpio, inst37_adf_muxout_cnt, inst37_fx3_clk_cnt,
       inst37_si5351c_clk_0_cnt, inst37_si5351c_clk_1_cnt, inst37_si5351c_clk_2_cnt,
       inst37_si5351c_clk_3_cnt, inst37_si5351c_clk_5_cnt, inst37_si5351c_clk_6_cnt,
       inst37_si5351c_clk_7_cnt, memcfg_mac, pllcfg_auto_phcfg_smpls, pllcfg_auto_phcfg_step, spi_ss,
       TX_TST_I, TX_TST_Q, wfm0_ch_en, wfm1_ch_en;
  wire [23:0] inst37_lmk_clk_cnt;
  wire [27:0] lbfifo_q;
  wire [31:0] dac_tx_stream_sw_fifo_data, dac_tx_stream_sw_wfm1_data, exfifo_if_d, exfifo_of_d,
       lms1_rcnfig_readdata, lms1_rcnfig_writedata, lms1_stream_sw_fifo_data, lms1_stream_sw_wfm0_data,
       lms2_rcnfig_readdata, lms2_rcnfig_writedata, lms2_stream_sw_fifo_data, lms2_stream_sw_wfm1_data,
       pll_rst, strm0_IN_q, strm1_IN_q, strm2_IN_q;
  wire [55:0] ADC_IQ_interleaved;
  wire [63:0] adc_rx_path_data, adc_rx_smpl_nr_cnt, cfg_from_fpgapll, cfg_from_lms2_rxpll,
       cfg_from_lms2_txpll, cfg_from_rxpll, cfg_from_txpll, cfg_to_fpgapll, cfg_to_lms2_rxpll,
       cfg_to_lms2_txpll, cfg_to_rxpll, cfg_to_txpll, lms1_rx_path_data, lms2_rx_path_data;

  not inst40 (inst40_out, exfifo_rst);
  not inst21 (fpga_reset_n, EXT_GND);
  clock_test inst37 (
    .FX3_clk(CLK100_FPGA), .reset_n(fpga_reset_n), .test_en(test_en[3:0]),
    .test_frc_err(test_inject_error[3:0]), .Si5351C_clk_0(SI_CLK0), .Si5351C_clk_1(SI_CLK1),
    .Si5351C_clk_2(1'b0), .Si5351C_clk_3(1'b0), .Si5351C_clk_5(1'b0), .Si5351C_clk_6(SI_CLK6),
    .Si5351C_clk_7(SI_CLK7), .LMK_CLK(CLK_LMK_FPGA_IN), .ADF_MUXOUT(ADF_MUXOUT), .test_cmplt(clk_test_cmplt),
    .test_rez(clk_test_rez), .FX3_clk_cnt(inst37_fx3_clk_cnt), .Si5351C_clk_0_cnt(inst37_si5351c_clk_0_cnt),
    .Si5351C_clk_1_cnt(inst37_si5351c_clk_1_cnt), .Si5351C_clk_2_cnt(inst37_si5351c_clk_2_cnt),
    .Si5351C_clk_3_cnt(inst37_si5351c_clk_3_cnt), .Si5351C_clk_5_cnt(inst37_si5351c_clk_5_cnt),
    .Si5351C_clk_6_cnt(inst37_si5351c_clk_6_cnt), .Si5351C_clk_7_cnt(inst37_si5351c_clk_7_cnt),
    .LMK_CLK_cnt(inst37_lmk_clk_cnt), .ADF_MUXOUT_cnt(inst37_adf_muxout_cnt));
  nios_cpu_top inst175 (
    .clk100(CLK_LMK_FPGA_IN), .fpga_spi0_MISO(nios_FPGA_SPI0_MISO), .pllcfg_MISO(pllcfg_misoB),
    .gpi0({{7{1'b0}}, FPGA_SW2}),
    .pll_cmd({pllcfg_phcfg_mode, pllrst_start_1bit, phcfg_start_1bit, pllcfg_start_1bit}),
    .pll_recfg_from_pll0(cfg_from_txpll), .pll_recfg_from_pll1(cfg_from_rxpll),
    .pll_recfg_from_pll2(cfg_from_lms2_txpll), .pll_recfg_from_pll3(cfg_from_lms2_rxpll),
    .pll_recfg_from_pll4(cfg_from_fpgapll), .pll_recfg_from_pll5({64{1'b0}}), .exfifo_if_d(exfifo_if_d),
    .exfifo_if_rdempty(exfifo_if_rdempty), .exfifo_of_wrfull(exfifo_of_wrfull),
    .avmm_s0_address(lms1_rcnfig_address), .avmm_s0_read(lms1_rcnfig_read),
    .avmm_s0_write(lms1_rcnfig_write), .avmm_s0_writedata(lms1_rcnfig_writedata),
    .avmm_s1_address(lms2_rcnfig_address), .avmm_s1_read(lms2_rcnfig_read),
    .avmm_s1_write(lms2_rcnfig_write), .avmm_s1_writedata(lms2_rcnfig_writedata),
    .vctcxo_tune_en(limegnns_en), .vctcxo_irq(limegnss_av_irq), .avmm_m0_waitrequest(limegnss_av_waitreq),
    .avmm_m0_readdata(limegnss_av_rddata), .avmm_m0_readdatavalid(limegnss_av_datav),
    .fpga_spi0_MOSI(FPGA_SPI0_MOSI), .fpga_spi0_SCLK(FPGA_SPI0_SCLK),
    .fpga_spi0_SS_n({nios_FPGA_SPI0_SS_n, FPGA_SPI0_LMS2_SS, FPGA_SPI0_LMS1_SS}), .pllcfg_MOSI(pllcfg_MOSI),
    .pllcfg_SCLK(pllcfg_SCLK), .pllcfg_SS_n(pllcfg_SEN), .gpio0({gpio0, FPGA_ADC_RESET}),
    .pll_stat(pllcfg_status), .pll_recfg_to_pll0(cfg_to_txpll), .pll_recfg_to_pll1(cfg_to_rxpll),
    .pll_recfg_to_pll2(cfg_to_lms2_txpll), .pll_recfg_to_pll3(cfg_to_lms2_rxpll),
    .pll_recfg_to_pll4(cfg_to_fpgapll), .pll_rst(pll_rst), .exfifo_if_rd(exfifo_if_rd),
    .exfifo_of_d(exfifo_of_d), .exfifo_of_wr(exfifo_of_wr), .exfifo_rst(exfifo_rst),
    .avmm_s0_readdata(lms1_rcnfig_readdata), .avmm_s0_waitrequest(lms1_rcnfig_waitrequest),
    .avmm_s1_readdata(lms2_rcnfig_readdata), .avmm_s1_waitrequest(lms2_rcnfig_waitrequest),
    .avmm_m0_address(nios_avm_address), .avmm_m0_read(nios_avm_read), .avmm_m0_write(nios_avm_write),
    .avmm_m0_writedata(nios_avm_write_data), .avmm_m0_clk_clk(nios_avm_clk),
    .avmm_m0_reset_reset(nios_avm_reset), .scl(I2C_SCL), .sda(I2C_SDA));  // open: nrst, pll_recfg_to_pll5
  pcie_top #(.dev_family("Cyclone V GX"), .pcie_ctrl0_dataw(32), .pcie_strm0_dataw(32), .pcie_strm1_dataw(32), .pcie_strm2_dataw(32)) inst46 (
    .pcie_perstn(PCIE_PERSTn), .pcie_refclk(PCIE_REFCLK), .clk100(CLK100_FPGA), .pcie_rx(PCIE_HSO),
    .ctrl0_IN_rdclk(CLK_LMK_FPGA_IN), .ctrl0_IN_aclr_n(fpga_reset_n), .ctrl0_IN_rdreq(exfifo_if_rd),
    .ctrl0_OUT_wrclk(CLK_LMK_FPGA_IN), .ctrl0_OUT_aclr_n(inst40_out), .ctrl0_OUT_wrreq(exfifo_of_wr),
    .ctrl0_OUT_data(exfifo_of_d), .strm0_IN_ext_rdy(strm0_sw_ready), .strm0_OUT_wrclk(lms1_rxpll_c1),
    .strm0_OUT_aclr_n(stream_rxen[0]), .strm0_OUT_wrreq(lms1_rxpatx_wr), .strm0_OUT_data(lms1_rx_path_data),
    .strm1_IN_ext_rdy(strm1_sw_ready), .strm1_OUT_wrclk(lms2_rxpll_c1), .strm1_OUT_aclr_n(lml_p1_rx_en),
    .strm1_OUT_wrreq(lms2_rxpatx_wr), .strm1_OUT_data(lms2_rx_path_data), .strm2_IN_ext_rdy(strm2_sw_rdy),
    .strm2_OUT_wrclk(ADC_CLKOUT), .strm2_OUT_aclr_n(lml_p2_rx_en), .strm2_OUT_wrreq(adc_rxpatx_wr),
    .strm2_OUT_data(adc_rx_path_data), .pcie_tx(PCIE_HSI), .pcie_bus_clk(pcie_bus_clk),
    .ctrl0_IN_rdempty(exfifo_if_rdempty), .ctrl0_IN_q(exfifo_if_d), .ctrl0_OUT_wrfull(exfifo_of_wrfull),
    .strm0_IN_q(strm0_IN_q), .strm0_IN_ext_q_valid(strm0_IN_ext_q_valid),
    .strm0_IN_open(pcie_top_strm0_IN_open), .strm0_OUT_wrfull(strm0_OUT_wrfull),
    .strm0_OUT_wrusedw(strm0_OUT_wrusedw), .strm1_IN_q(strm1_IN_q),
    .strm1_IN_ext_q_valid(strm1_IN_ext_q_valid), .strm1_IN_open(pcie_top_strm1_IN_open),
    .strm1_OUT_wrfull(strm1_OUT_wrfull), .strm1_OUT_wrusedw(strm1_OUT_wrusedw), .strm2_IN_q(strm2_IN_q),
    .strm2_IN_ext_q_valid(strm2_IN_ext_q_valid), .strm2_IN_open(pcie_top_strm2_IN_open),
    .strm2_OUT_wrusedw(strm2_OUT_wrusedw));  // open: ctrl0_IN_rdusedw, ctrl0_OUT_wrusedw, strm2_OUT_wrfull
  fpgacfg inst58 (
    .maddress({10{1'b0}}), .mimo_en(1'b1), .sdin(FPGA_SPI0_MOSI), .sclk(FPGA_SPI0_SCLK),
    .sen(nios_FPGA_SPI0_SS_n[6]), .lreset(fpga_reset_n), .mreset(fpga_reset_n), .mac_en(memcfg_mac[0]),
    .HW_VER(HW_VER), .BOM_VER(BOM_VER), .sdout(fpgacfg_0_sdout), .ch_en(ch_en), .smpl_width(smpl_width),
    .mimo_int_en(mimo_en), .synch_dis(tx_synch_dis), .dlb_en(lml_p0_dlb_en), .smpl_nr_clr(smpl_nr_clr),
    .txpct_loss_clr(txpct_loss_clr), .rx_en(stream_rxen), .tx_en(stream_txen), .tx_ptrn_en(lml_p0_txptrn_en),
    .tx_cnt_en(lml_p0_txcnt_en), .wfm_play(wfm_play), .wfm_load(wfm_load), .wfm0_ch_en(wfm0_ch_en),
    .wfm0_smpl_width(wfm0_smpl_width), .wfm1_ch_en(wfm1_ch_en), .wfm1_smpl_width(wfm1_smpl_width),
    .SPI_SS(spi_ss), .LMS1_RESET(LMS1_RESET), .LMS1_CORE_LDO_EN(LMS1_CORE_LDO_EN), .LMS1_TXNRX1(LMS1_TXNRX1),
    .LMS1_TXNRX2(LMS1_TXNRX2), .LMS1_TXEN(LMS1_TXEN), .LMS1_RXEN(LMS1_RXEN), .LMS2_RESET(LMS2_RESET),
    .LMS2_CORE_LDO_EN(LMS2_CORE_LDO_EN), .LMS2_TXNRX1(LMS2_TXNRX1), .LMS2_TXNRX2(LMS2_TXNRX2),
    .LMS2_TXEN(LMS2_TXEN), .LMS2_RXEN(LMS2_RXEN), .GPIO(fpgacfg_gpio), .data_src(data_src), .mac(mac));  // open: oen, stateo, phase_reg_sel, clk_ind, cnt_ind, load_phase_reg, drct_clk_en, rx_ptrn_en, LMS1_SS, LMS2_SS, FPGA_LED1_CTRL, FPGA_LED2_CTRL, FX3_LED_CTRL, FCLK_ENA
  lmlicfg_wrapp inst73 (
    .maddress({10{1'b0}}), .mimo_en(1'b1), .sdin(FPGA_SPI0_MOSI), .sclk(FPGA_SPI0_SCLK),
    .sen(nios_FPGA_SPI0_SS_n[6]), .lreset(fpga_reset_n), .mreset(fpga_reset_n), .mac_en(memcfg_mac[1]),
    .sdout(fpgacfg_1_sdout), .lmli_ch_en(lml_p1_ch_en), .lmli_smpl_width(lml_p1_smpl_width),
    .lmli_mimo_int_en(lml_p1_mimo_int_en), .lmli_synch_dis(lml_p1_synch_dis), .lmli_dlb_en(lml_p1_dlb_en),
    .lmli_smpl_nr_clr(lml_p1_smpl_nr_clr), .lmli_txpct_loss_clr(lml_p1_txpct_loss_clr),
    .lmli_rx_en(lml_p1_rx_en), .lmli_tx_ptrn_en(lml_p1_txptrn_en), .lmli_tx_cnt_en(lml_p1_txcnt_en),
    .wfm_play(lml_p1_wfm_play), .wfm_load(lml_p1_wfm_load), .wfm_ch_en(lml_p1_wfm0_ch_en),
    .wfm_smpl_width(lml_p1_wfm0_smpl_width));  // open: lmli_tx_en, lmli_rx_ptrn_en
  lmlicfg_wrapp inst74 (
    .maddress({10{1'b0}}), .mimo_en(1'b1), .sdin(FPGA_SPI0_MOSI), .sclk(FPGA_SPI0_SCLK),
    .sen(nios_FPGA_SPI0_SS_n[6]), .lreset(fpga_reset_n), .mreset(fpga_reset_n), .mac_en(memcfg_mac[2]),
    .sdout(fpgacfg_2_sdout), .lmli_ch_en(lml_p2_ch_en), .lmli_smpl_width(lml_p2_smpl_width),
    .lmli_mimo_int_en(lml_p2_mimo_int_en), .lmli_synch_dis(lml_p2_synch_dis), .lmli_dlb_en(lml_p2_dlb_en),
    .lmli_smpl_nr_clr(lml_p2_smpl_nr_clr), .lmli_txpct_loss_clr(lml_p2_txpct_loss_clr),
    .lmli_rx_en(lml_p2_rx_en), .wfm_play(lml_p2_wfm_play), .wfm_load(lml_p2_wfm_load),
    .wfm_ch_en(lml_p2_wfm0_ch_en), .wfm_smpl_width(lml_p2_wfm0_smpl_width));  // open: lmli_tx_en, lmli_rx_ptrn_en, lmli_tx_ptrn_en, lmli_tx_cnt_en
  pllcfg_top #(.n_pll(5)) inst28 (
    .maddress(10'b0000000001), .sdinA(FPGA_SPI0_MOSI), .sclkA(FPGA_SPI0_SCLK), .senA(nios_FPGA_SPI0_SS_n[6]),
    .sdinB(pllcfg_MOSI), .sclkB(pllcfg_SCLK), .senB(pllcfg_SEN), .lreset(fpga_reset_n),
    .mreset(fpga_reset_n), .pllcfg_busy(pllcfg_status[1]), .pllcfg_done(pllcfg_status[0]),
    .pllcfg_err(pllcfg_status[9:2]),
    .pll_lock({fpga_pll_locked, lms2_rxpll_locked, lms2_txpll_locked, lms1_rxpll_locked, lms1_txpll_locked}),
    .auto_phcfg_done({1'b0, lms2_rxpll_dynps_done, lms2_txpll_dynps_done, lms1_rxpll_dynps_done, lms1_txpll_dynps_done}),
    .auto_phcfg_err({1'b0, lms2_rxpll_dynps_status, lms2_txpll_dynps_status, lms1_rxpll_dynps_status, lms1_txpll_dynps_status}),
    .sdoutA(pllcfg_sdoutA), .sdoutB(pllcfg_misoB), .phcfg_mode(pllcfg_phcfg_mode),
    .phcfg_tst(pllcfg_phcfg_tst), .phcfg_start_b(phcfg_start_1bit), .phcfg_start(phcfg_start),
    .pllcfg_start_b(pllcfg_start_1bit), .pllcfg_start(pllcfg_start), .pllrst_start_b(pllrst_start_1bit),
    .pllrst_start(pllrst_start), .phcfg_updn(phcfg_updn), .cnt_ind(cnt_ind), .cnt_phase(cnt_phase),
    .auto_phcfg_smpls(pllcfg_auto_phcfg_smpls), .auto_phcfg_step(pllcfg_auto_phcfg_step));  // open: oenA, oenB
  memcfg inst4 (
    .maddress({10{1'b1}}), .mimo_en(1'b1), .sdin(FPGA_SPI0_MOSI), .sclk(FPGA_SPI0_SCLK),
    .sen(nios_FPGA_SPI0_SS_n[6]), .lreset(fpga_reset_n), .mreset(fpga_reset_n), .sdout(memcfg_sdout),
    .mac(memcfg_mac));  // open: oen, stateo
  wfm_player_x2_top #(.dev_family("Cyclone V"), .mem_cntrl_rate(1), .mem_dq_width(32), .mem_dqs_width(4), .mem_addr_width(14), .mem_ba_width(3), .mem_dm_width(4), .avl_0_addr_width(26), .avl_0_data_width(64), .avl_0_burst_count_width(2), .avl_0_be_width(8), .avl_0_max_burst_count(2), .avl_0_rd_latency_words(64), .avl_0_traffic_gen_buff_size(16), .avl_1_addr_width(26), .avl_1_data_width(64), .avl_1_burst_count_width(2), .avl_1_be_width(8), .avl_1_max_burst_count(2), .avl_1_rd_latency_words(64), .avl_1_traffic_gen_buff_size(16), .wfm_0_infifo_wrusedw_width(12), .wfm_0_infifo_wdata_width(32), .wfm_0_outfifo_rdusedw_width(10), .wfm_0_outfifo_rdata_width(64), .wfm_1_infifo_wrusedw_width(12), .wfm_1_infifo_wdata_width(32), .wfm_1_outfifo_rdusedw_width(10), .wfm_1_outfifo_rdata_width(64), .wfm_0_iq_width(12), .wfm_1_iq_width(14)) inst20 (
    .clk(CLK125_FPGA_BOT), .reset_n(fpga_reset_n), .wfm_0_load(wfm_load_delayed),
    .wfm_0_play_stop(wfm_play[0]), .wfm_0_infifo_wclk(pcie_bus_clk),
    .wfm_0_infifo_wrreq(lms1_stream_sw_wfm0_wr), .wfm_0_infifo_wdata(lms1_stream_sw_wfm0_data),
    .wfm_0_outfifo_rclk(lms1_txpll_c1), .wfm_1_load(lml_p2_wfm_load_delayed),
    .wfm_1_play_stop(lml_p2_wfm_play_delayed), .wfm_1_infifo_wclk(pcie_bus_clk),
    .wfm_1_infifo_wrreq(dac_tx_stream_sw_wfm1_wr), .wfm_1_infifo_wdata(dac_tx_stream_sw_wfm1_data),
    .wfm_1_outfifo_rclk(dac_data_clk), .oct_rzqin(OCT_RZQIN0),
    .wfm_0_infifo_wfull(inst20_wfm_0_infifo_wfull), .wfm_0_infifo_wrusedw(wfm0_infifo_wrusedw),
    .wfm_0_Aiq_h(wfm0_iq_h), .wfm_0_Aiq_l(wfm0_iq_l), .wfm_1_infifo_wfull(inst20_wfm_1_infifo_wfull),
    .wfm_1_infifo_wrusedw(wfm1_dac_infifo_wrusedw), .wfm_1_Aiq_h(wfm1_dac_Aiq_h),
    .wfm_1_Aiq_l(wfm1_dac_Aiq_l), .wfm_1_Biq_h(wfm1_dac_Biq_h), .wfm_1_Biq_l(wfm1_dac_Biq_l),
    .mem_a(DDR3_BOT_A), .mem_ba(DDR3_BOT_BA), .mem_ck(DDR3_BOT_CK_P[0]), .mem_ck_n(DDR3_BOT_CK_N[0]),
    .mem_cke(DDR3_BOT_CKE[0]), .mem_cs_n(DDR3_BOT_CSn[0]), .mem_dm(DDR3_BOT_DM),
    .mem_ras_n(DDR3_BOT_RASn[0]), .mem_cas_n(DDR3_BOT_CASn[0]), .mem_we_n(DDR3_BOT_WEn[0]),
    .mem_reset_n(DDR3_BOT_RESETn), .mem_odt(DDR3_BOT_ODT[0]), .phy_clk(DDR3_BOT_phy_clk),
    .mem_dq(DDR3_BOT_DQ), .mem_dqs(DDR3_BOT_DQS_P), .mem_dqs_n(DDR3_BOT_DQS_N));  // open: wfm_0_sample_width, wfm_0_fr_start, wfm_0_ch_en, wfm_0_mimo_en, wfm_0_intrlv_dis, wfm_0_infifo_reset_n, wfm_0_outfifo_reset_n, wfm_0_xen, wfm_1_sample_width, wfm_1_fr_start, wfm_1_ch_en, wfm_1_mimo_en, wfm_1_intrlv_dis, wfm_1_infifo_reset_n, wfm_1_outfifo_reset_n, wfm_1_xen, wfm_0_Biq_h, wfm_0_Biq_l
  limegnss_gpio_top #(.UART_BAUD_RATE(9600), .VCTCXO_CLOCK_FREQUENCY(30720000)) inst53 (
    .areset_n(fpga_reset_n), .tamercfg_maddress(10'b0000000111), .gnsscfg_maddress(10'b0000001000),
    .sdin(FPGA_SPI0_MOSI), .sclk(FPGA_SPI0_SCLK), .sen(nios_FPGA_SPI0_SS_n[6]), .lreset(fpga_reset_n),
    .mreset(fpga_reset_n), .vctcxo_clk(CLK_LMK_FPGA_IN), .gnss_rx(GNSS_TX), .gnss_tpulse(GNSS_TPULSE),
    .gnss_fix(GNSS_FIX), .mm_clock(nios_avm_clk), .mm_reset(nios_avm_reset), .mm_rd_req(nios_avm_read),
    .mm_wr_req(nios_avm_write), .mm_addr(nios_avm_address), .mm_wr_data(nios_avm_write_data),
    .sdout(limegnss_sdout), .fpga_led_g(limegnss_led_g), .fpga_led_r(limegnss_led_r), .en(limegnns_en),
    .mm_rd_data(limegnss_av_rddata), .mm_rd_datav(limegnss_av_datav), .mm_wait_req(limegnss_av_waitreq),
    .mm_irq(limegnss_av_irq));  // open: gnss_tx
  wfm_player_x2_top #(.dev_family("Cyclone V"), .mem_cntrl_rate(1), .mem_dq_width(32), .mem_dqs_width(4), .mem_addr_width(14), .mem_ba_width(3), .mem_dm_width(4), .avl_0_addr_width(26), .avl_0_data_width(64), .avl_0_burst_count_width(2), .avl_0_be_width(8), .avl_0_max_burst_count(2), .avl_0_rd_latency_words(64), .avl_0_traffic_gen_buff_size(16), .avl_1_addr_width(26), .avl_1_data_width(64), .avl_1_burst_count_width(2), .avl_1_be_width(8), .avl_1_max_burst_count(2), .avl_1_rd_latency_words(64), .avl_1_traffic_gen_buff_size(16), .wfm_0_infifo_wrusedw_width(12), .wfm_0_infifo_wdata_width(32), .wfm_0_outfifo_rdusedw_width(10), .wfm_0_outfifo_rdata_width(64), .wfm_1_infifo_wrusedw_width(12), .wfm_1_infifo_wdata_width(32), .wfm_1_outfifo_rdusedw_width(10), .wfm_1_outfifo_rdata_width(64), .wfm_0_iq_width(12), .wfm_1_iq_width(12)) inst2 (
    .clk(CLK125_FPGA_TOP), .reset_n(fpga_reset_n), .wfm_0_load(lml_p1_wfm_load_delayed),
    .wfm_0_play_stop(lml_p1_wfm_play), .wfm_0_infifo_wclk(pcie_bus_clk),
    .wfm_0_infifo_wrreq(lms2_stream_sw_wfm1_wr), .wfm_0_infifo_wdata(lms2_stream_sw_wfm1_data),
    .wfm_0_outfifo_rclk(lms2_txpll_c1), .wfm_1_infifo_wclk(pcie_bus_clk), .oct_rzqin(OCT_RZQIN1),
    .wfm_0_infifo_wfull(inst2_wfm_0_infifo_wfull), .wfm_0_infifo_wrusedw(wfm1_infifo_wrusedw),
    .wfm_0_Aiq_h(wfm1_iq_h), .wfm_0_Aiq_l(wfm1_iq_l), .mem_a(DDR3_TOP_A), .mem_ba(DDR3_TOP_BA),
    .mem_ck(DDR3_TOP_CK_P[0]), .mem_ck_n(DDR3_TOP_CK_N[0]), .mem_cke(DDR3_TOP_CKE[0]),
    .mem_cs_n(DDR3_TOP_CSn[0]), .mem_dm(DDR3_TOP_DM), .mem_ras_n(DDR3_TOP_RASn[0]),
    .mem_cas_n(DDR3_TOP_CASn[0]), .mem_we_n(DDR3_TOP_WEn[0]), .mem_reset_n(DDR3_TOP_RESETn),
    .mem_odt(DDR3_TOP_ODT[0]), .phy_clk(DDR3_TOP_phy_clk), .mem_dq(DDR3_TOP_DQ), .mem_dqs(DDR3_TOP_DQS_P),
    .mem_dqs_n(DDR3_TOP_DQS_N));  // open: wfm_0_sample_width, wfm_0_fr_start, wfm_0_ch_en, wfm_0_mimo_en, wfm_0_intrlv_dis, wfm_0_infifo_reset_n, wfm_0_outfifo_reset_n, wfm_0_xen, wfm_1_load, wfm_1_play_stop, wfm_1_sample_width, wfm_1_fr_start, wfm_1_ch_en, wfm_1_mimo_en, wfm_1_intrlv_dis, wfm_1_infifo_reset_n, wfm_1_infifo_wrreq, wfm_1_infifo_wdata, wfm_1_outfifo_rclk, wfm_1_outfifo_reset_n, wfm_1_xen, wfm_0_Biq_h, wfm_0_Biq_l, wfm_1_infifo_wfull, wfm_1_infifo_wrusedw, wfm_1_Aiq_h, wfm_1_Aiq_l, wfm_1_Biq_h, wfm_1_Biq_l
  tstcfg inst39 (
    .maddress(10'b0000000011), .mimo_en(1'b1), .sdin(FPGA_SPI0_MOSI), .sclk(FPGA_SPI0_SCLK),
    .sen(nios_FPGA_SPI0_SS_n[6]), .lreset(fpga_reset_n), .mreset(fpga_reset_n),
    .FX3_CLK_CNT(inst37_fx3_clk_cnt), .Si5351C_CLK0_CNT(inst37_si5351c_clk_0_cnt),
    .Si5351C_CLK1_CNT(inst37_si5351c_clk_1_cnt), .Si5351C_CLK2_CNT(inst37_si5351c_clk_2_cnt),
    .Si5351C_CLK3_CNT(inst37_si5351c_clk_3_cnt), .Si5351C_CLK5_CNT(inst37_si5351c_clk_5_cnt),
    .Si5351C_CLK6_CNT(inst37_si5351c_clk_6_cnt), .Si5351C_CLK7_CNT(inst37_si5351c_clk_7_cnt),
    .LMK_CLK_CNT(inst37_lmk_clk_cnt), .ADF_CNT(inst37_adf_muxout_cnt), .sdout(tstcfg_sdout),
    .TEST_EN(test_en), .TEST_FRC_ERR(test_inject_error), .TX_TST_I(TX_TST_I), .TX_TST_Q(TX_TST_Q));  // open: TEST_CMPLT, TEST_REZ, DDR2_1_STATUS, DDR2_1_pnf_per_bit, DDR2_2_STATUS, DDR2_2_pnf_per_bit, oen, stateo
  busy_delay #(.clock_period(10), .delay_time(200)) inst27 (
    .clk(CLK100_FPGA), .reset_n(fpga_reset_n), .busy_in(FX3_FPGA_GPIO5), .busy_out(busy));
  alive inst52 (.rst(fpga_reset_n), .clk(CLK_LMK_FPGA_IN), .beat22(alive_beat));  // open: beat21
  or inst100 (inst100_out, fpgacfg_0_sdout, fpgacfg_1_sdout, fpgacfg_2_sdout);
  signal_delay inst3 (
    .clk(pcie_bus_clk), .reset_n(fpga_reset_n), .sign_in0(lml_p1_wfm_load),
    .sign_in1(pcie_top_strm1_IN_open), .sign_out(lml_p1_wfm_load_delayed));
  signal_delay inst12 (
    .clk(pcie_bus_clk), .reset_n(fpga_reset_n), .sign_in0(lml_p2_wfm_load),
    .sign_in1(pcie_top_strm2_IN_open), .sign_out(lml_p2_wfm_load_delayed));
  IC_74HC595_top inst1 (
    .clk(CLK_LMK_FPGA_IN), .reset_n(fpga_reset_n), .data(fpgacfg_gpio), .SHCP(SR_SCLK_LS),
    .STCP(SR_LATCH_LS), .DS(SR_DIN_LS));  // open: busy
  BUSMUX #(.WIDTH(1)) inst51 (
    .datab(1'b0), .sel(lml_p2_wfm_load_delayed), .dataa(lml_p2_wfm_play), .result(lml_p2_wfm_play_delayed));
  and inst22 (common_cs, 1'b1, 1'b1, spi_ss[0], spi_ss[1], spi_ss[2], 1'b1);
  not inst117 (inst117_out, nios_FPGA_SPI0_SS_n[4]);
  not inst116 (inst116_out, nios_FPGA_SPI0_SS_n[5]);
  or inst24 (inst24_out, inst100_out, pllcfg_sdoutA, rxtspcfg_sdout, txtspcfg_sdout, tsp_chB_sdout, tstcfg_sdout);
  and inst115 (inst115_out, inst117_out, 1'b0);
  and inst114 (inst114_out, inst116_out, FPGA_SPI0_MISO_ADC);
  stream_switch #(.data_width(32), .wfm_fifo_wrusedw_size(12), .wfm_limit(4096)) inst41 (
    .clk(pcie_bus_clk), .reset_n(fpga_reset_n), .data_in(strm0_IN_q), .data_in_valid(strm0_IN_ext_q_valid),
    .dest_sel(wfm_load_delayed), .tx_fifo_rdy(lms1_txpath_pct_fifo_rdy), .wfm_rdy(wfm0_rdy),
    .wfm_fifo_wrusedw(wfm0_infifo_wrusedw), .data_in_rdy(strm0_sw_ready),
    .tx_fifo_wr(lms1_stream_sw_fifo_wr), .tx_fifo_data(lms1_stream_sw_fifo_data),
    .wfm_fifo_wr(lms1_stream_sw_wfm0_wr), .wfm_data(lms1_stream_sw_wfm0_data));
  stream_switch #(.data_width(32), .wfm_fifo_wrusedw_size(12), .wfm_limit(4096)) inst31 (
    .clk(pcie_bus_clk), .reset_n(fpga_reset_n), .data_in(strm1_IN_q), .data_in_valid(strm1_IN_ext_q_valid),
    .dest_sel(lml_p1_wfm_load_delayed), .tx_fifo_rdy(lms2_txpath_pct_fifo_rdy), .wfm_rdy(wfm1_rdy),
    .wfm_fifo_wrusedw(wfm1_infifo_wrusedw), .data_in_rdy(strm1_sw_ready),
    .tx_fifo_wr(lms2_stream_sw_fifo_wr), .tx_fifo_data(lms2_stream_sw_fifo_data),
    .wfm_fifo_wr(lms2_stream_sw_wfm1_wr), .wfm_data(lms2_stream_sw_wfm1_data));
  stream_switch #(.data_width(32), .wfm_fifo_wrusedw_size(12), .wfm_limit(4096)) inst64 (
    .clk(pcie_bus_clk), .reset_n(fpga_reset_n), .data_in(strm2_IN_q), .data_in_valid(strm2_IN_ext_q_valid),
    .dest_sel(lml_p2_wfm_load_delayed), .tx_fifo_rdy(dac_tx_in_pct_rdy), .wfm_rdy(wfm1_dac_rdy),
    .wfm_fifo_wrusedw(wfm1_dac_infifo_wrusedw), .data_in_rdy(strm2_sw_rdy),
    .tx_fifo_wr(dac_tx_stream_sw_fifo_wr), .tx_fifo_data(dac_tx_stream_sw_fifo_data),
    .wfm_fifo_wr(dac_tx_stream_sw_wfm1_wr), .wfm_data(dac_tx_stream_sw_wfm1_data));
  not inst72 (wfm0_rdy, inst20_wfm_0_infifo_wfull);
  not inst54 (wfm1_dac_rdy, inst20_wfm_1_infifo_wfull);
  not inst71 (wfm1_rdy, inst2_wfm_0_infifo_wfull);
  miso_mux inst18 (
    .fpga_miso(int_fpga_spi_miso), .ext_miso(1'b0), .fpga_cs(FX3_SPI_FPGA_SS), .ext_cs(common_cs),
    .out_miso(FX3_SPI_MISO));
  or inst69 (int_fpga_spi_miso, inst24_out, memcfg_sdout);
  or inst118 (inst118_out, inst115_out, inst114_out);
  not inst10 (inst10_out, busy);
  and inst8 (lms1_plls_locked, lms1_txpll_locked_i, lms1_rxpll_locked_i);
  and inst9 (lms2_plls_locked, lms2_txpll_locked_i, lms2_rxpll_locked_i);
  signal_delay inst32 (
    .clk(pcie_bus_clk), .reset_n(fpga_reset_n), .sign_in0(wfm_load[0]), .sign_in1(pcie_top_strm0_IN_open),
    .sign_out(wfm_load_delayed));
  OPNDRN inst110 (.IN(nios_FPGA_SPI0_SS_n[2]), .OUT(FPGA_SPI0_ADF_SS));
  OPNDRN inst112 (.IN(nios_FPGA_SPI0_SS_n[8]), .OUT(FPGA_SPI0_DAC_SS));
  OPNDRN inst113 (.IN(nios_FPGA_SPI0_SS_n[5]), .OUT(FPGA_SPI0_ADC_SS));
  OPNDRN inst749 (.IN(alive_beat), .OUT(FPGA_LED1));
  OPNDRN inst750 (.IN(fpga_pll_locked_i), .OUT(FPGA_LED2));
  OPNDRN inst760 (.IN(lms1_plls_locked), .OUT(FPGA_LED3));
  OPNDRN inst761 (.IN(lms2_plls_locked), .OUT(FPGA_LED4));
  OPNDRN inst762 (.IN(busy), .OUT(FPGA_LED5_G));
  OPNDRN inst763 (.IN(inst10_out), .OUT(FPGA_LED5_R));
  BUSMUX #(.WIDTH(1)) inst61 (.datab(1'b1), .sel(FPGA_SW3), .dataa(LM75_OS), .result(FAN_CTRL));
  or inst55 (nios_FPGA_SPI0_MISO, int_fpga_spi_miso, inst118_out, FPGA_SPI0_MISO_LMS1, FPGA_SPI0_MISO_LMS2, limegnss_sdout);
  gclk_ctrl inst78 (.inclk(LMS2_MCLK1), .outclk(lms2_mclk1_global));
  gclk_ctrl inst79 (.inclk(LMS2_MCLK2), .outclk(lms2_mclk2_global));
  not inst42 (inst42_out, pll_rst[1]);
  not inst29 (inst29_out, pll_rst[0]);
  gclk_ctrl inst77 (.inclk(CLK_LMK_FPGA_IN), .outclk(inst77_outclk));
  lms7_rxtx_top #(.dev_family("Cyclone V"), .rx_ddio_clkinv("ON"), .rx_diq_width(12), .rx_smpl_buff_rdusedw_w(11), .rx_pct_fifo_wrusedw_w(12), .tx_diq_width(12), .tx_pct_size_w(16), .tx_n_buff(4), .tx_in_pct_data_w(32), .tx_out_pct_data_w(64), .tx_decomp_fifo_size(9)) inst120 (
    .free_running_clk(CLK_LMK_FPGA_IN), .logic_reset_n(fpga_reset_n), .lml_smpl_width(smpl_width),
    .lml_mode(1'b0), .lml_trxiqpulse(1'b0), .lml_ddr_en(1'b0), .lml_mimo_en(mimo_en), .lml_ch_en(ch_en[1:0]),
    .lml_fidm(1'b0), .rx_pll_in_clk(LMS1_MCLK2), .rx_pll_areset(pll_rst[1]),
    .rx_pll_logic_reset_n(fpga_reset_n), .rx_pll_rcnfg_in(cfg_to_rxpll),
    .rx_pll_dynps_mode(pllcfg_phcfg_mode), .rx_pll_dynps_areset_n(inst42_out),
    .rx_pll_dynps_en(phcfg_start[1]), .rx_pll_dynps_tst(pllcfg_phcfg_tst), .rx_pll_dynps_dir(phcfg_updn),
    .rx_pll_dynps_cnt_sel(cnt_ind), .rx_pll_dynps_phase(cnt_phase[9:0]),
    .rx_pll_dynps_step_size(pllcfg_auto_phcfg_step[9:0]), .rx_clk_en(2'b11), .rx_drct_clk_en(2'b00),
    .rx_io_reset_n(stream_rxen[0]), .rx_logic_reset_n(stream_rxen[0]), .rx_tst_ptrn_en(1'b0),
    .rx_smpl_src_sel(1'b0), .rx_smpl_fifo_wrreq(1'b0), .rx_smpl_fifo_data({48{1'b0}}), .rx_diq(LMS1_DIQ2_D),
    .rx_diq_fsync(LMS1_ENABLE_IQSEL2), .rx_smpl_nr_clr(smpl_nr_clr[0]), .rx_smpl_nr_ld(1'b0),
    .rx_pct_loss_flg_clr(txpct_loss_clr[0]), .rx_pct_fifo_wrusedw(strm0_OUT_wrusedw),
    .tx_pll_in_clk(LMS1_MCLK1), .tx_pll_areset(pll_rst[0]), .tx_pll_logic_reset_n(fpga_reset_n),
    .tx_pll_rcnfg_in(cfg_to_txpll), .tx_pll_dynps_mode(pllcfg_phcfg_mode),
    .tx_pll_dynps_areset_n(inst29_out), .tx_pll_dynps_en(phcfg_start[0]),
    .tx_pll_dynps_tst(pllcfg_phcfg_tst), .tx_pll_dynps_dir(phcfg_updn), .tx_pll_dynps_cnt_sel(cnt_ind),
    .tx_pll_dynps_phase(cnt_phase[9:0]), .tx_pll_dynps_step_size(pllcfg_auto_phcfg_step[9:0]),
    .tx_clk_en(2'b11), .tx_drct_clk_en(2'b00), .tx_pct_wclk(pcie_bus_clk), .tx_io_reset_n(stream_rxen[0]),
    .tx_logic_reset_n(stream_rxen[0]), .tx_xen(1'b1), .tx_sync_dis(tx_synch_dis), .tx_par_mode_en(1'b0),
    .tx_pct_wrreq(lms1_stream_sw_fifo_wr), .tx_pct_data(lms1_stream_sw_fifo_data),
    .pll_rcnfg_mgmt_readdata(lms1_rcnfig_readdata), .pll_rcnfg_mgmt_waitrequest(lms1_rcnfig_waitrequest),
    .rx_pll_c0(LMS1_FCLK2), .rx_pll_c1(lms1_rxpll_c1), .rx_pll_locked(lms1_rxpll_locked),
    .rx_pll_rcnfg_out(cfg_from_rxpll), .rx_pll_dynps_done(lms1_rxpll_dynps_done),
    .rx_pll_dynps_status(lms1_rxpll_dynps_status), .rx_diq_h(lms1_rxdiq_h), .rx_diq_l(lms1_rxdiq_l),
    .rx_pct_fifo_wrreq(lms1_rxpatx_wr), .rx_pct_fifo_wdata(lms1_rx_path_data), .tx_pll_c0(LMS1_FCLK1),
    .tx_pll_c1(lms1_txpll_c1), .tx_pll_locked(lms1_txpll_locked), .tx_pll_rcnfg_out(cfg_from_txpll),
    .tx_pll_dynps_done(lms1_txpll_dynps_done), .tx_pll_dynps_status(lms1_txpll_dynps_status),
    .tx_pct_full(inst120_tx_pct_full), .tx_diqab_h(lms1_txpath_h), .tx_diqab_l(lms1_txpath_l),
    .pll_rcnfg_mgmt_read(lms1_rcnfig_read), .pll_rcnfg_mgmt_write(lms1_rcnfig_write),
    .pll_rcnfg_mgmt_address(lms1_rcnfig_address), .pll_rcnfg_mgmt_writedata(lms1_rcnfig_writedata));  // open: rx_smpl_nr_in, rx_pll_dynps_busy, rx_smpl_fifo_wfull, rx_smpl_fifo_wrreq_out, rx_smpl_nr_out, tx_pll_dynps_busy, tx_diq, tx_diq_fsync, tx_diqb_h, tx_diqb_l
  not inst43 (inst43_out, pll_rst[3]);
  not inst49 (inst49_out, pll_rst[2]);
  lms7_rxtx_top #(.dev_family("Cyclone V"), .rx_ddio_clkinv("ON"), .rx_diq_width(12), .rx_smpl_buff_rdusedw_w(11), .rx_pct_fifo_wrusedw_w(12), .tx_diq_width(12), .tx_pct_size_w(16), .tx_n_buff(4), .tx_in_pct_data_w(32), .tx_out_pct_data_w(64), .tx_decomp_fifo_size(9)) inst121 (
    .free_running_clk(CLK_LMK_FPGA_IN), .logic_reset_n(fpga_reset_n), .lml_smpl_width(lml_p1_smpl_width),
    .lml_mode(1'b0), .lml_trxiqpulse(1'b0), .lml_ddr_en(1'b0), .lml_mimo_en(lml_p1_mimo_int_en),
    .lml_ch_en(lml_p1_ch_en), .lml_fidm(1'b0), .rx_pll_in_clk(lms2_mclk2_global), .rx_pll_areset(pll_rst[3]),
    .rx_pll_logic_reset_n(fpga_reset_n), .rx_pll_rcnfg_in(cfg_to_lms2_rxpll),
    .rx_pll_dynps_mode(pllcfg_phcfg_mode), .rx_pll_dynps_areset_n(inst43_out),
    .rx_pll_dynps_en(phcfg_start[3]), .rx_pll_dynps_tst(pllcfg_phcfg_tst), .rx_pll_dynps_dir(phcfg_updn),
    .rx_pll_dynps_cnt_sel(cnt_ind), .rx_pll_dynps_phase(cnt_phase[9:0]),
    .rx_pll_dynps_step_size(pllcfg_auto_phcfg_step[9:0]), .rx_clk_en(2'b11), .rx_drct_clk_en(2'b00),
    .rx_io_reset_n(lml_p1_rx_en), .rx_logic_reset_n(lml_p1_rx_en), .rx_tst_ptrn_en(1'b0),
    .rx_smpl_src_sel(1'b0), .rx_smpl_fifo_wrreq(1'b0), .rx_smpl_fifo_data({48{1'b0}}), .rx_diq(LMS2_DIQ2_D),
    .rx_diq_fsync(LMS2_ENABLE_IQSEL2), .rx_smpl_nr_clr(lml_p1_smpl_nr_clr), .rx_smpl_nr_ld(1'b0),
    .rx_pct_loss_flg_clr(lml_p1_txpct_loss_clr), .rx_pct_fifo_wrusedw(strm1_OUT_wrusedw),
    .tx_pll_in_clk(lms2_mclk1_global), .tx_pll_areset(pll_rst[2]), .tx_pll_logic_reset_n(fpga_reset_n),
    .tx_pll_rcnfg_in(cfg_to_lms2_txpll), .tx_pll_dynps_mode(pllcfg_phcfg_mode),
    .tx_pll_dynps_areset_n(inst49_out), .tx_pll_dynps_en(phcfg_start[2]),
    .tx_pll_dynps_tst(pllcfg_phcfg_tst), .tx_pll_dynps_dir(phcfg_updn), .tx_pll_dynps_cnt_sel(cnt_ind),
    .tx_pll_dynps_phase(cnt_phase[9:0]), .tx_pll_dynps_step_size(pllcfg_auto_phcfg_step[9:0]),
    .tx_clk_en(2'b11), .tx_drct_clk_en(2'b00), .tx_pct_wclk(pcie_bus_clk), .tx_io_reset_n(lml_p1_rx_en),
    .tx_logic_reset_n(lml_p1_rx_en), .tx_xen(1'b1), .tx_sync_dis(lml_p1_synch_dis), .tx_par_mode_en(1'b0),
    .tx_pct_wrreq(lms2_stream_sw_fifo_wr), .tx_pct_data(lms2_stream_sw_fifo_data),
    .pll_rcnfg_mgmt_readdata(lms2_rcnfig_readdata), .pll_rcnfg_mgmt_waitrequest(lms2_rcnfig_waitrequest),
    .rx_pll_c0(LMS2_FCLK2), .rx_pll_c1(lms2_rxpll_c1), .rx_pll_locked(lms2_rxpll_locked),
    .rx_pll_rcnfg_out(cfg_from_lms2_rxpll), .rx_pll_dynps_done(lms2_rxpll_dynps_done),
    .rx_pll_dynps_status(lms2_rxpll_dynps_status), .rx_diq_h(lms2_rdiq_h), .rx_diq_l(lms2_rdiq_l),
    .rx_pct_fifo_wrreq(lms2_rxpatx_wr), .rx_pct_fifo_wdata(lms2_rx_path_data), .tx_pll_c0(LMS2_FCLK1),
    .tx_pll_c1(lms2_txpll_c1), .tx_pll_locked(lms2_txpll_locked), .tx_pll_rcnfg_out(cfg_from_lms2_txpll),
    .tx_pll_dynps_done(lms2_txpll_dynps_done), .tx_pll_dynps_status(lms2_txpll_dynps_status),
    .tx_pct_full(inst121_tx_pct_full), .tx_diqab_h(lms2_txpath_data_h), .tx_diqab_l(lms2_txpath_data_l),
    .pll_rcnfg_mgmt_read(lms2_rcnfig_read), .pll_rcnfg_mgmt_write(lms2_rcnfig_write),
    .pll_rcnfg_mgmt_address(lms2_rcnfig_address), .pll_rcnfg_mgmt_writedata(lms2_rcnfig_writedata));  // open: rx_smpl_nr_in, rx_pll_dynps_busy, rx_smpl_fifo_wfull, rx_smpl_fifo_wrreq_out, rx_smpl_nr_out, tx_pll_dynps_busy, tx_diq, tx_diq_fsync, tx_diqb_h, tx_diqb_l
  or inst19 (inst19_out, lml_p2_rx_en, lml_p2_dlb_en);
  fpga_pll inst34 (
    .refclk(inst77_outclk), .rst(pll_rst[4]), .reconfig_to_pll(cfg_to_fpgapll), .outclk_0(clk_to_adc),
    .outclk_1(dac_data_clk), .locked(fpga_pll_locked), .reconfig_from_pll(cfg_from_fpgapll));
  adc_top #(.dev_family("Cyclone V"), .data_width(7), .smpls_to_capture(4)) inst130 (
    .clk(ADC_CLKOUT), .reset_n(fpga_pll_locked), .en(inst19_out), .sclk(FPGA_SPI0_SCLK),
    .sdin(FPGA_SPI0_MOSI), .sen(nios_FPGA_SPI0_SS_n[6]), .memrstn(fpga_reset_n), .mac_en(memcfg_mac[0]),
    .ch_a(ADC_DA), .ch_b(ADC_DB), .sdout(rxtspcfg_sdout), .data_ch_a(ADC_I), .data_ch_b(ADC_Q),
    .data_ch_ab(ADC_IQ_interleaved), .data_ch_ab_valid(ADC_IQ_interleaved_valid));  // open: test_out
  not inst25 (lms1_rxpll_locked_i, lms1_rxpll_locked);
  not inst30 (lms1_txpll_locked_i, lms1_txpll_locked);
  not inst124 (lms1_txpath_pct_fifo_rdy, inst120_tx_pct_full);
  not inst35 (fpga_pll_locked_i, fpga_pll_locked);
  not inst65 (lms2_rxpll_locked_i, lms2_rxpll_locked);
  not inst66 (lms2_txpll_locked_i, lms2_txpll_locked);
  not inst125 (lms2_txpath_pct_fifo_rdy, inst121_tx_pct_full);
  ddrox1 inst13 (.datain_h(1'b1), .datain_l(1'b0), .outclock(clk_to_adc), .dataout(ADC_CLK));
  ddrox1 inst33 (.datain_h(1'b0), .datain_l(1'b1), .outclock(dac_data_clk), .dataout(DAC_CLK_WRT));
  rx_path_top #(.dev_family("Cyclone V"), .iq_width(14), .invert_input_clocks("ON"), .smpl_buff_rdusedw_w(11), .pct_buff_wrusedw_w(12)) inst127 (
    .clk(ADC_CLKOUT), .reset_n(lml_p2_rx_en), .io_reset_n(fpga_pll_locked), .test_ptrn_en(1'b0),
    .smpl_src_sel(1'b1), .sample_width(lml_p2_smpl_width), .mode(1'b0), .trxiqpulse(1'b0), .ddr_en(1'b1),
    .mimo_en(lml_p2_mimo_int_en), .ch_en(lml_p2_ch_en), .fidm(1'b0), .DIQ(virtddioq), .fsync(virtfsync),
    .smpl_fifo_wrreq(ADC_IQ_interleaved_valid), .smpl_fifo_data(ADC_IQ_interleaved),
    .pct_fifo_wusedw(strm2_OUT_wrusedw), .clr_smpl_nr(lml_p2_smpl_nr_clr), .ld_smpl_nr(1'b0),
    .smpl_nr_in({64{1'b0}}), .tx_pct_loss(dac_tx_path_pct_loss_flg), .tx_pct_loss_clr(lml_p2_txpct_loss_clr),
    .pct_fifo_wrreq(adc_rxpatx_wr), .pct_fifo_wdata(adc_rx_path_data), .smpl_nr_cnt(adc_rx_smpl_nr_cnt));  // open: DIQ_h, DIQ_l, smpl_fifo_wfull, smpl_fifo_wrreq_out
  rx_chain inst105 (
    .clk(ADC_CLKOUT), .nrst(fpga_pll_locked), .sclk(FPGA_SPI0_SCLK), .sdin(FPGA_SPI0_MOSI),
    .sen(nios_FPGA_SPI0_SS_n[6]), .memrstn(fpga_reset_n), .mac_en(memcfg_mac[1]), .RXI({18{1'b0}}),
    .RXQ({18{1'b0}}), .sdout(rxtspcfg_chB_sdout));  // open: HBD_ratio, xen, RYI, RYQ
  or inst111 (tsp_chB_sdout, rxtspcfg_chB_sdout, txtspcfg_chB_sdout);
  tx_path_top #(.dev_family("Cyclone IV E"), .iq_width(14), .pct_size_w(16), .n_buff(4), .in_pct_data_w(32), .out_pct_data_w(64), .decomp_fifo_size(9)) inst (
    .pct_wrclk(pcie_bus_clk), .iq_rdclk(dac_data_clk), .reset_n(lml_p2_rx_en), .en(lml_p2_rx_en), .xen(1'b1),
    .rx_sample_clk(ADC_CLKOUT), .rx_sample_nr(adc_rx_smpl_nr_cnt), .pct_sync_dis(lml_p2_synch_dis),
    .pct_loss_flg_clr(lml_p2_txpct_loss_clr), .mode(1'b0), .trxiqpulse(1'b0), .ddr_en(1'b1),
    .mimo_en(lml_p2_mimo_int_en), .ch_en(lml_p2_ch_en), .fidm(1'b0), .sample_width(lml_p2_smpl_width),
    .par_mode_en(1'b1), .in_pct_wrreq(dac_tx_stream_sw_fifo_wr), .in_pct_data(dac_tx_stream_sw_fifo_data),
    .pct_loss_flg(dac_tx_path_pct_loss_flg), .DIQAB_h(dac_tx_path_iq_h), .DIQAB_l(dac_tx_path_iq_l),
    .DIQB_h(dac_tx_path_iq_chB_h), .DIQB_l(dac_tx_path_iq_chB_l), .in_pct_full(inst_in_pct_full));  // open: DIQ, fsync
  not inst16 (dac_tx_in_pct_rdy, inst_in_pct_full);
  lpm_mux14 inst85 (
    .data1x(wfm1_dac_Biq_h), .data0x(dac_tx_path_iq_chB_h), .clock(dac_data_clk),
    .sel(lml_p2_wfm_play_delayed), .result(dac_txB_mux_h));
  lpm_mux14 inst91 (
    .data1x(wfm1_dac_Biq_l), .data0x(dac_tx_path_iq_chB_l), .clock(dac_data_clk),
    .sel(lml_p2_wfm_play_delayed), .result(dac_txB_mux_l));
  lpm_mux14 inst84 (
    .data1x(wfm1_dac_Aiq_h), .data0x(dac_tx_path_iq_h), .clock(dac_data_clk), .sel(lml_p2_wfm_play_delayed),
    .result(dac_txA_mux_h));
  lpm_mux14 inst90 (
    .data1x(wfm1_dac_Aiq_l), .data0x(dac_tx_path_iq_l), .clock(dac_data_clk), .sel(lml_p2_wfm_play_delayed),
    .result(dac_txA_mux_l));
  tx_chain inst82 (
    .clk(dac_data_clk), .nrst(fpga_pll_locked), .maddress(10'b0000000100), .sclk(FPGA_SPI0_SCLK),
    .sdin(FPGA_SPI0_MOSI), .sen(nios_FPGA_SPI0_SS_n[6]), .memrstn(fpga_reset_n), .mac_en(memcfg_mac[0]),
    .TXI({dac_txA_mux_h[13:0], 4'b0000}), .TXQ({dac_txA_mux_l[13:0], 4'b0000}), .sdout(txtspcfg_sdout),
    .TYI(dac_txchain_I_ch_a), .TYQ(dac_txchain_Q_ch_a));
  tx_chain inst86 (
    .clk(dac_data_clk), .nrst(fpga_pll_locked), .maddress(10'b0000000100), .sclk(FPGA_SPI0_SCLK),
    .sdin(FPGA_SPI0_MOSI), .sen(nios_FPGA_SPI0_SS_n[6]), .memrstn(fpga_reset_n), .mac_en(memcfg_mac[1]),
    .TXI({dac_txB_mux_h[13:0], 4'b0000}), .TXQ({dac_txB_mux_l[13:0], 4'b0000}), .sdout(txtspcfg_chB_sdout),
    .TYI(dac_txchain_I_ch_b), .TYQ(dac_txchain_Q_ch_b));
  not inst44 (inst44_out, inst36_wrfull);
  not inst45 (inst45_out, inst36_rdempty);
  lb_fifo inst36 (
    .data({ADC_Q, ADC_I}), .wrreq(inst44_out), .wrclk(ADC_CLKOUT), .rdreq(inst45_out), .rdclk(dac_data_clk),
    .aclr(fpga_pll_locked_i), .wrfull(inst36_wrfull), .q(lbfifo_q), .rdempty(inst36_rdempty));
  txiqmux #(.diq_width(12)) inst14 (
    .clk(lms1_txpll_c1), .reset_n(lms1_txpll_locked), .test_ptrn_en(lml_p0_txptrn_en), .test_ptrn_fidm(1'b0),
    .test_ptrn_I(TX_TST_I), .test_ptrn_Q(TX_TST_Q), .test_data_en(lml_p0_txcnt_en), .test_data_mimo_en(1'b1),
    .mux_sel(wfm_play[0]), .tx_diq_h(lms1_txpath_h), .tx_diq_l(lms1_txpath_l), .wfm_diq_h(wfm0_iq_h),
    .wfm_diq_l(wfm0_iq_l), .diq_h(inst14_diq_h), .diq_l(inst14_diq_l));
  txiqmux #(.diq_width(12)) inst7 (
    .clk(lms2_txpll_c1), .reset_n(lms2_txpll_locked), .test_ptrn_en(lml_p1_txptrn_en), .test_ptrn_fidm(1'b0),
    .test_ptrn_I(TX_TST_I), .test_ptrn_Q(TX_TST_Q), .test_data_en(lml_p1_txcnt_en), .test_data_mimo_en(1'b1),
    .mux_sel(lml_p1_wfm_play), .tx_diq_h(lms2_txpath_data_h), .tx_diq_l(lms2_txpath_data_l),
    .wfm_diq_h(wfm1_iq_h), .wfm_diq_l(wfm1_iq_l), .diq_h(inst7_diq_h), .diq_l(inst7_diq_l));
  lpm_mux14 inst87 (
    .data1x({1'b0, lbfifo_q[27:14]}), .data0x({1'b0, dac_txchain_I_ch_a}), .clock(dac_data_clk),
    .sel(lml_p2_dlb_en), .result(lb_mux_I));
  lpm_mux14 inst92 (
    .data1x({1'b0, lbfifo_q[13:0]}), .data0x({1'b0, dac_txchain_Q_ch_a}), .clock(dac_data_clk),
    .sel(lml_p2_dlb_en), .result(lb_mux_Q));
  lms7002_ddout #(.dev_family("Cyclone IV E"), .iq_width(12)) inst26 (
    .clk(lms1_txpll_c1), .reset_n(lms1_txpll_locked), .data_in_h(inst14_diq_h), .data_in_l(inst14_diq_l),
    .txiq(LMS1_DIQ1_D), .txiqsel(LMS1_ENABLE_IQSEL1));
  lms7002_ddout #(.dev_family("Cyclone IV E"), .iq_width(12)) inst11 (
    .clk(lms2_txpll_c1), .reset_n(lms2_txpll_locked), .data_in_h(inst7_diq_h), .data_in_l(inst7_diq_l),
    .txiq(LMS2_DIQ1_D), .txiqsel(LMS2_ENABLE_IQSEL1));
  sign_to_uns_std inst23 (
    .clk(dac_data_clk), .reset_n(fpga_pll_locked), .signd_in(lb_mux_I[13:0]), .unsgnd_out(inst23_unsgnd_out));
  sign_to_uns_std inst15 (
    .clk(dac_data_clk), .reset_n(fpga_pll_locked), .signd_in(lb_mux_Q[13:0]), .unsgnd_out(inst15_unsgnd_out));
  sign_to_uns_std inst68 (
    .clk(dac_data_clk), .reset_n(fpga_pll_locked), .signd_in(dac_txchain_I_ch_b),
    .unsgnd_out(inst68_unsgnd_out));
  sign_to_uns_std inst48 (
    .clk(dac_data_clk), .reset_n(fpga_pll_locked), .signd_in(dac_txchain_Q_ch_b),
    .unsgnd_out(inst48_unsgnd_out));
  ddro14 inst96 (
    .datain_h(inst23_unsgnd_out), .datain_l(inst23_unsgnd_out), .outclock(dac_data_clk),
    .aclr(fpga_pll_locked_i), .dataout(DAC1_DA));
  ddro14 inst95 (
    .datain_h(inst15_unsgnd_out), .datain_l(inst15_unsgnd_out), .outclock(dac_data_clk),
    .aclr(fpga_pll_locked_i), .dataout(DAC1_DB));
  ddro14 inst99 (
    .datain_h(inst68_unsgnd_out), .datain_l(inst68_unsgnd_out), .outclock(dac_data_clk),
    .aclr(fpga_pll_locked_i), .dataout(DAC2_DA));
  ddro14 inst97 (
    .datain_h(inst48_unsgnd_out), .datain_l(inst48_unsgnd_out), .outclock(dac_data_clk),
    .aclr(fpga_pll_locked_i), .dataout(DAC2_DB));

  assign DAC1_MODE = 1'b1;
  assign DAC1_SLEEP = 1'b0;
  assign PMOD_A_PIN1 = 1'b0;
  assign PMOD_A_PIN2 = 1'b0;
  assign PMOD_A_PIN3 = 1'b0;
  assign PMOD_A_PIN4 = 1'b0;
  assign PMOD_A_PIN7 = 1'b0;
  assign PMOD_A_PIN8 = 1'b0;
  assign PMOD_A_PIN9 = 1'b0;

  // Other names for the same wires on the sheet: adc_pllclk = ADC_CLKOUT; clk_fpga2 = CLK_LMK_FPGA_IN;
  //   fpga_reset = EXT_GND; gpio0[0] = FPGA_ADC_RESET; lms1_rxpll_c0 = LMS1_FCLK2; lms1_txpll_c0 = LMS1_FCLK1;
  //   lms2_rxpll_c0 = LMS2_FCLK2; lms2_txpll_c0 = LMS2_FCLK1; lms_reset = LMS1_RESET; MCLK1TX = LMS1_MCLK1;
  //   MCLK2RX = LMS1_MCLK2; nios_FPGA_SPI0_MOSI = FPGA_SPI0_MOSI; nios_FPGA_SPI0_SCLK = FPGA_SPI0_SCLK;
  //   nios_FPGA_SPI0_SS_n[1:0] = {FPGA_SPI0_LMS2_SS, FPGA_SPI0_LMS1_SS}; sw0 = FPGA_SW0; sw1 = FPGA_SW1;
  //   sw2 = FPGA_SW2; sw3 = FPGA_SW3

  // Notes on the sheet:
  //   FPGA MISC
  //   LMS7002#1
  //   General I/O, ect
  //   LMS7002#1 TX
  //   Board SPI
  //   FPGA_SPI0_MISO
  //   LMS7002#2
  //   LMS7002#2 Clocks
  //   LMS7002#2 RX
  //   TX Path
  //   External ADC and DAC
  //   PLL`s and pll control
  //   FPGA registers
  //   fpga_spi0_SS_n[0]: LMS #1
  //   fpga_spi0_SS_n[1]: LMS #2
  //   fpga_spi0_SS_n[2]: ADF4002
  //   fpga_spi0_SS_n[3]: -----
  //   fpga_spi0_SS_n[4]: Pot
  //   ADC
  //   ADC
  //   fpga_spi0_SS_n[5]: Data ADC
  //   NIOS CPU
  //   fpga_spi0_SS_n[6]: PLL CFG
  //   fpga_spi0_SS_n[7]: -----
  //   fpga_spi0_SS_n[8]: External IQ data ADC
  //   FPGA_SPI0_MISO
  //   PCIE core
  //   TX an RX correctors
  //   Tx chain
  //   DAC
  //   lml_p2_wfm_play[2..0]
  //   H - Dual-bus mode, L - single-bus interleaved mode
  //   L - Normal Operation, H - power-down mode
  //   LMS7 CH_A
  //   diq_out_uns_l[13..0]
  //   WFM loading buffer (External DDR3 memory)
  //   diq_out_uns_h[13..0]
  //   LMS7 CH_B
  //   DESCRIPTION
  //   BOARD
  //   RF-qSpark v1r0
  //   DATE
  //   2016-03-21
  //   AUTHOR
  //   Lime Microsystems
  //   REVISION
  //   v1r0
endmodule
